# EAGLE schematic core (EAGLE 9.4.2), part 1 of 2

## Sheet 1 of 13: CPU General
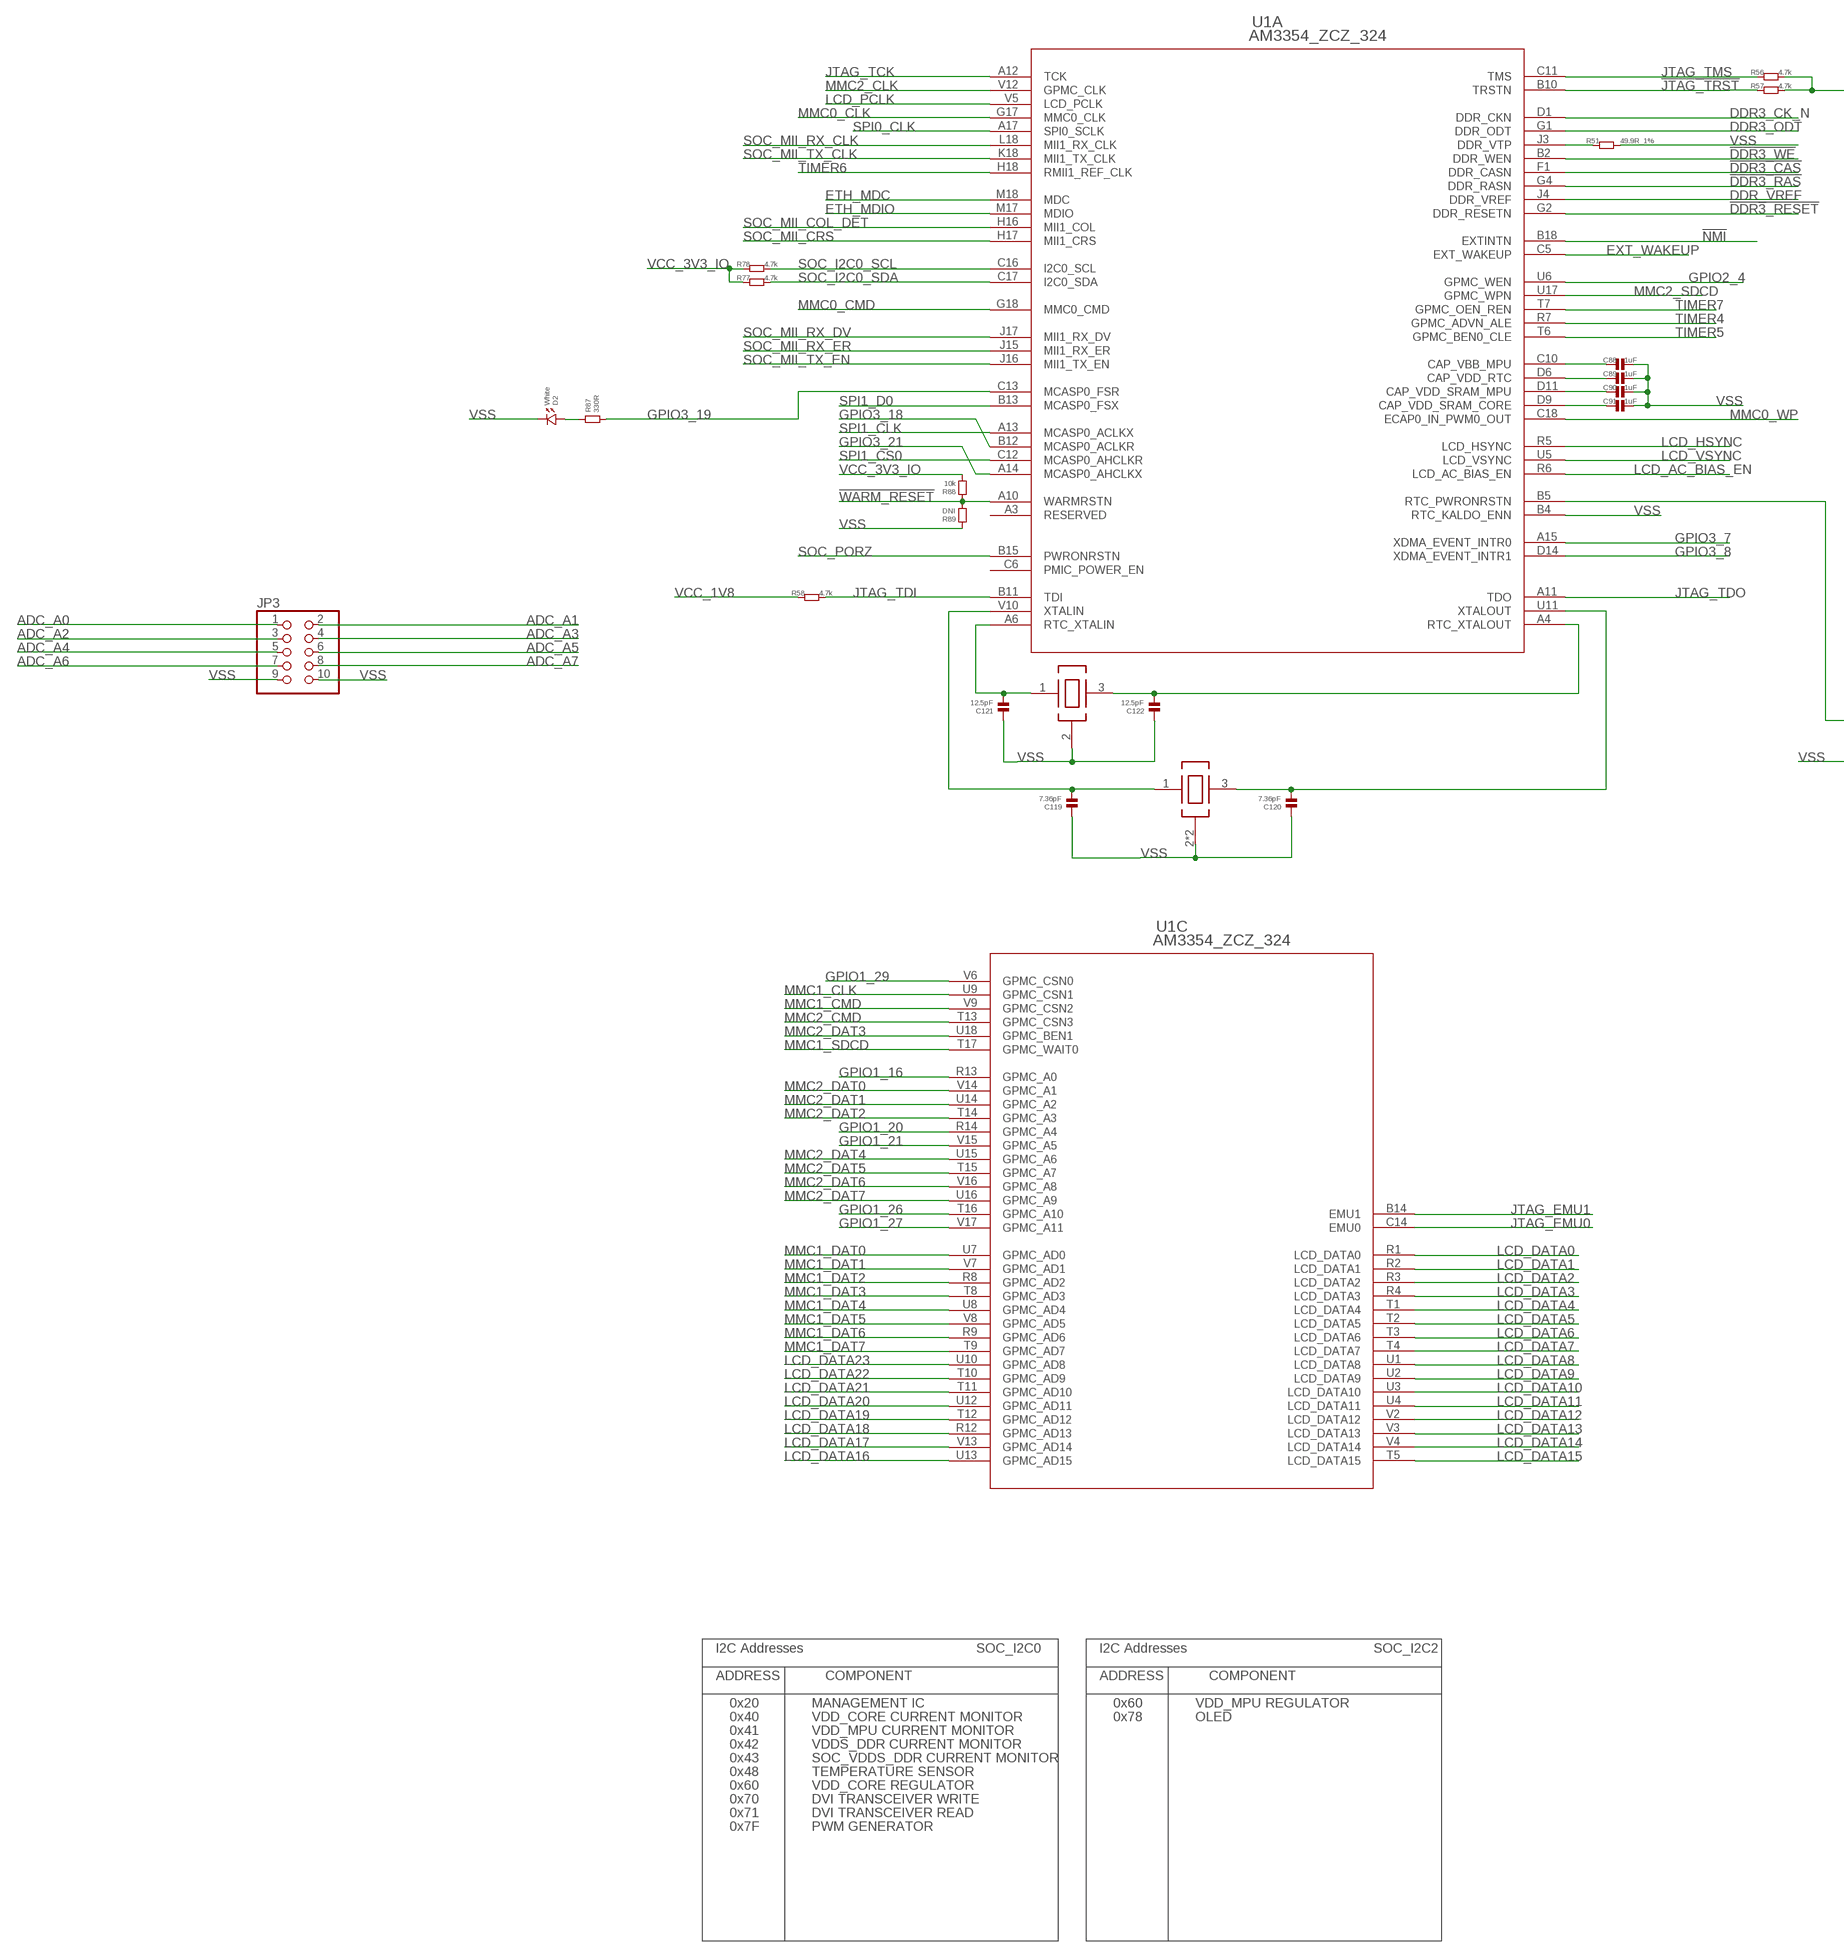
[diagram p0: schematic, sheet 1, part 1 of 2]
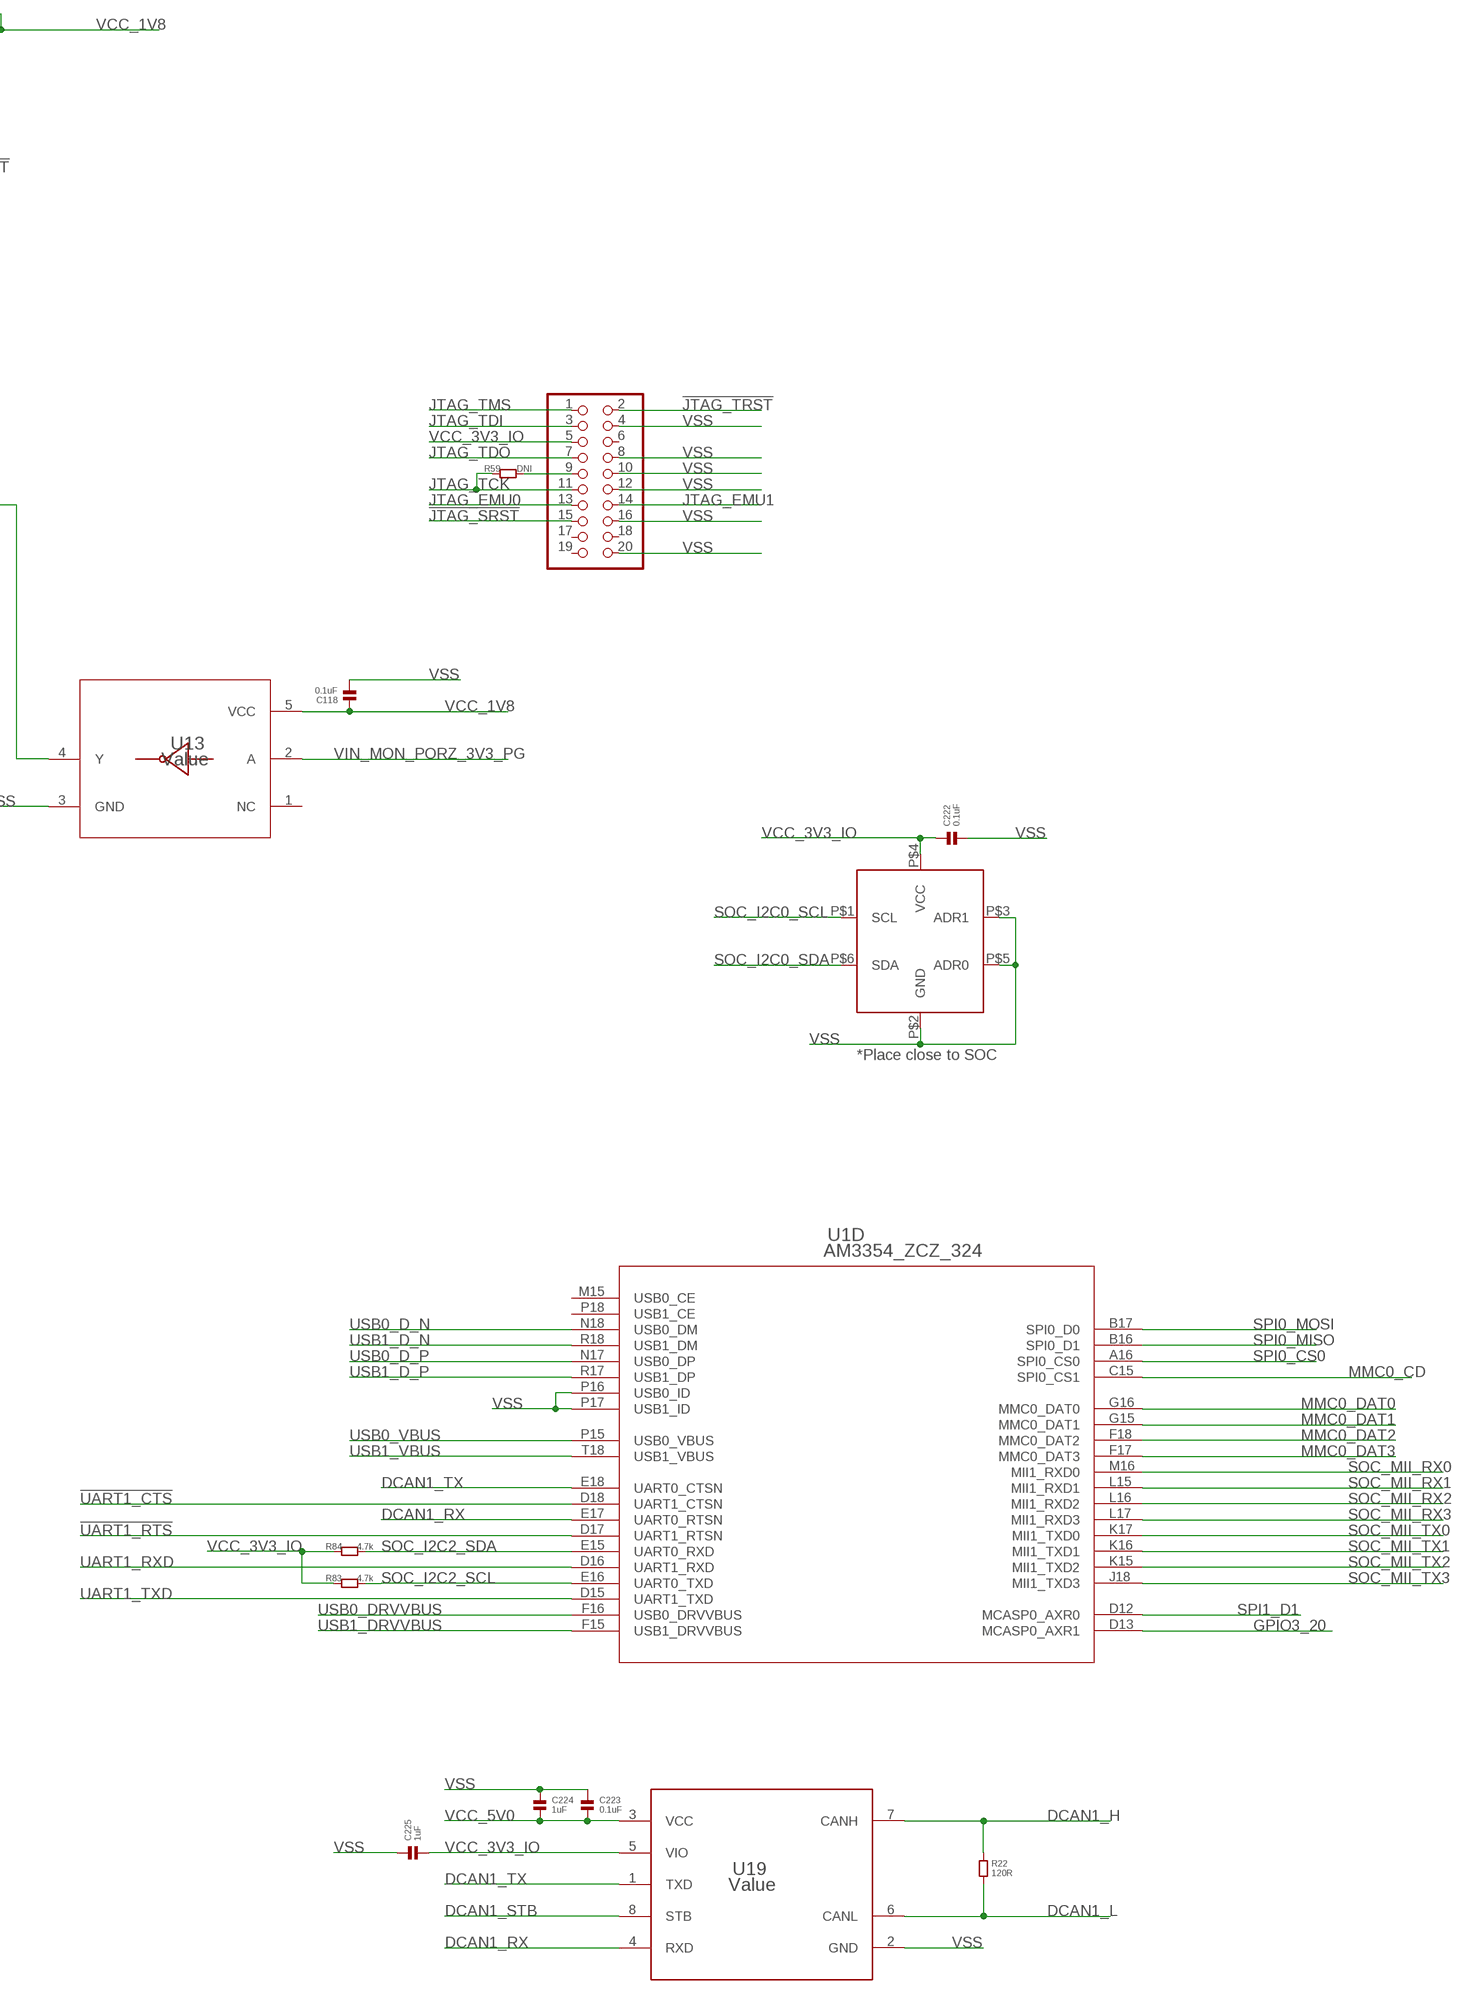
[diagram p1: schematic, sheet 1, part 2 of 2]

### Parts
C88  1uF  CAPACITOR.0201  [0201]
C89  1uF  CAPACITOR.0201  [0201]
C90  1uF  CAPACITOR.0201  [0201]
C91  1uF  CAPACITOR.0201  [0201]
C118  0.1uF  CAPACITOR.0402  [0402]
C119  7.36pF  CAPACITOR.0402  [0402]
C120  7.36pF  CAPACITOR.0402  [0402]
C121  12.5pF  CAPACITOR.0402  [0402]
C122  12.5pF  CAPACITOR.0402  [0402]
C222  0.1uF  CAPACITOR.0402  [0402]
C223  0.1uF  CAPACITOR.0402  [0402]
C224  1uF  CAPACITOR.0402  [0402]
C225  1uF  CAPACITOR.0402  [0402]
D2  White  LED.0603  [0603.LED]
JP1  PINHD-2X10  [2X10]
JP3  PINHD-2X5  [2X05]
R22  120R  RESISTOR.0402  [0402]
R51  49.9R_1%  RESISTOR.0201  [0201]
R56  4.7k  RESISTOR.0603  [0603]
R57  4.7k  RESISTOR.0603  [0603]
R58  4.7k  RESISTOR.0603  [0603]
R59  DNI  RESISTOR.0402  [0402]
R77  4.7k  RESISTOR.0402  [0402]
R78  4.7k  RESISTOR.0402  [0402]
R83  4.7k  RESISTOR.0402  [0402]
R84  4.7k  RESISTOR.0402  [0402]
R87  330R  RESISTOR.0603  [0603]
R88  10k  RESISTOR.0402  [0402]
R89  DNI  RESISTOR.0402  [0402]
U1  AM3354_ZCZ_324  [ZCZ324]
U13  Value  SN74LVC1G04DCKR  [DCK0005A_N]
U19  Value  TCAN1042VDRQ1  [D0008A_N]
U$5  ECS-.327-12.5-1210B-N-TR  [OSCCC120X100X35]
U$6  NX3225SA-26.000000MHZ-G3  [OSCCC320X250X70]
U$9  TMP100  [SOT23-6]

### Nets
!DDR3_CAS: U1.F1(A:DDR_CASN) ; also sheet 3
!DDR3_RAS: U1.G4(A:DDR_RASN) ; also sheet 3
!DDR3_RESET: U1.G2(A:DDR_RESETN) ; also sheet 3
!DDR3_WE: U1.B2(A:DDR_WEN) ; also sheet 3
!JTAG_SRST: JP1.15
!JTAG_TRST: JP1.2 R57.1 U1.B10(A:TRSTN) ; also sheet 11
!NMI: U1.B18(A:EXTINTN) ; also sheet 12
!UART1_CTS: U1.D18(D:UART1_CTSN) ; also sheet 13
!UART1_RTS: U1.D17(D:UART1_RTSN) ; also sheet 13
!WARM_RESET: R88.1 R89.2 U1.A10(A:WARMRSTN) ; also sheet 13
ADC_A0: JP3.1 ; also sheet 3
ADC_A1: JP3.2 ; also sheet 3
ADC_A2: JP3.3 ; also sheet 3
ADC_A3: JP3.4 ; also sheet 3
ADC_A4: JP3.5 ; also sheet 3
ADC_A5: JP3.6 ; also sheet 3
ADC_A6: JP3.7 ; also sheet 3
ADC_A7: JP3.8 ; also sheet 3
DCAN1_H [6mil]: R22.1 U19.7(CANH) ; also sheet 13
DCAN1_L [6mil]: R22.2 U19.6(CANL) ; also sheet 13
DCAN1_RX: U1.E17(D:UART0_RTSN) U19.4(RXD)
DCAN1_STB: U19.8(STB) ; also sheet 12
DCAN1_TX: U1.E18(D:UART0_CTSN) U19.1(TXD)
DDR3_CK_N: U1.D1(A:DDR_CKN) ; also sheet 3
DDR3_ODT: U1.G1(A:DDR_ODT) ; also sheet 3
DDR_VREF: U1.J4(A:DDR_VREF) ; also sheet 3,9
ETH_MDC: U1.M18(A:MDC) ; also sheet 4
ETH_MDIO: U1.M17(A:MDIO) ; also sheet 4
EXT_WAKEUP: U1.C5(A:EXT_WAKEUP) ; also sheet 12,13
GPIO1_16: U1.R13(C:GPMC_A0) ; also sheet 13
GPIO1_20: U1.R14(C:GPMC_A4) ; also sheet 13
GPIO1_21: U1.V15(C:GPMC_A5) ; also sheet 13
GPIO1_26: U1.T16(C:GPMC_A10) ; also sheet 13
GPIO1_27: U1.V17(C:GPMC_A11) ; also sheet 13
GPIO1_29: U1.V6(C:GPMC_CSN0) ; also sheet 13
GPIO2_4: U1.U6(A:GPMC_WEN) ; also sheet 13
GPIO3_7: U1.A15(A:XDMA_EVENT_INTR0) ; also sheet 13
GPIO3_8: U1.D14(A:XDMA_EVENT_INTR1) ; also sheet 13
GPIO3_18: U1.B12(A:MCASP0_ACLKR) ; also sheet 13
GPIO3_19: R87.2 U1.C13(A:MCASP0_FSR) ; also sheet 13
GPIO3_20: U1.D13(D:MCASP0_AXR1) ; also sheet 13
GPIO3_21: U1.A14(A:MCASP0_AHCLKX) ; also sheet 13
JTAG_EMU0: JP1.13 U1.C14(C:EMU0)
JTAG_EMU1: JP1.14 U1.B14(C:EMU1)
JTAG_TCK: JP1.11 R59.1 U1.A12(A:TCK)
JTAG_TDI: JP1.3 R58.2 U1.B11(A:TDI)
JTAG_TDO: JP1.7 U1.A11(A:TDO)
JTAG_TMS: JP1.1 R56.1 U1.C11(A:TMS)
LCD_AC_BIAS_EN: U1.R6(A:LCD_AC_BIAS_EN) ; also sheet 6
LCD_DATA0: U1.R1(C:LCD_DATA0) ; also sheet 6
LCD_DATA1: U1.R2(C:LCD_DATA1) ; also sheet 6
LCD_DATA2: U1.R3(C:LCD_DATA2) ; also sheet 6
LCD_DATA3: U1.R4(C:LCD_DATA3) ; also sheet 6
LCD_DATA4: U1.T1(C:LCD_DATA4) ; also sheet 6
LCD_DATA5: U1.T2(C:LCD_DATA5) ; also sheet 6
LCD_DATA6: U1.T3(C:LCD_DATA6) ; also sheet 6
LCD_DATA7: U1.T4(C:LCD_DATA7) ; also sheet 6
LCD_DATA8: U1.U1(C:LCD_DATA8) ; also sheet 6
LCD_DATA9: U1.U2(C:LCD_DATA9) ; also sheet 6
LCD_DATA10: U1.U3(C:LCD_DATA10) ; also sheet 6
LCD_DATA11: U1.U4(C:LCD_DATA11) ; also sheet 6
LCD_DATA12: U1.V2(C:LCD_DATA12) ; also sheet 6
LCD_DATA13: U1.V3(C:LCD_DATA13) ; also sheet 6
LCD_DATA14: U1.V4(C:LCD_DATA14) ; also sheet 6
LCD_DATA15: U1.T5(C:LCD_DATA15) ; also sheet 6
LCD_DATA16: U1.U13(C:GPMC_AD15) ; also sheet 6
LCD_DATA17: U1.V13(C:GPMC_AD14) ; also sheet 6
LCD_DATA18: U1.R12(C:GPMC_AD13) ; also sheet 6
LCD_DATA19: U1.T12(C:GPMC_AD12) ; also sheet 6
LCD_DATA20: U1.U12(C:GPMC_AD11) ; also sheet 6
LCD_DATA21: U1.T11(C:GPMC_AD10) ; also sheet 6
LCD_DATA22: U1.T10(C:GPMC_AD9) ; also sheet 6
LCD_DATA23: U1.U10(C:GPMC_AD8) ; also sheet 6
LCD_HSYNC: U1.R5(A:LCD_HSYNC) ; also sheet 6
LCD_PCLK: U1.V5(A:LCD_PCLK) ; also sheet 6
LCD_VSYNC: U1.U5(A:LCD_VSYNC) ; also sheet 6
MMC0_CD: U1.C15(D:SPI0_CS1) ; also sheet 8
MMC0_CLK: U1.G17(A:MMC0_CLK) ; also sheet 8
MMC0_CMD: U1.G18(A:MMC0_CMD) ; also sheet 8
MMC0_DAT0: U1.G16(D:MMC0_DAT0) ; also sheet 8
MMC0_DAT1: U1.G15(D:MMC0_DAT1) ; also sheet 8
MMC0_DAT2: U1.F18(D:MMC0_DAT2) ; also sheet 8
MMC0_DAT3: U1.F17(D:MMC0_DAT3) ; also sheet 8
MMC0_WP: U1.C18(A:ECAP0_IN_PWM0_OUT) ; also sheet 8
MMC1_CLK: U1.U9(C:GPMC_CSN1) ; also sheet 8
MMC1_CMD: U1.V9(C:GPMC_CSN2) ; also sheet 8
MMC1_DAT0: U1.U7(C:GPMC_AD0) ; also sheet 8
MMC1_DAT1: U1.V7(C:GPMC_AD1) ; also sheet 8
MMC1_DAT2: U1.R8(C:GPMC_AD2) ; also sheet 8
MMC1_DAT3: U1.T8(C:GPMC_AD3) ; also sheet 8
MMC1_DAT4: U1.U8(C:GPMC_AD4) ; also sheet 8
MMC1_DAT5: U1.V8(C:GPMC_AD5) ; also sheet 8
MMC1_DAT6: U1.R9(C:GPMC_AD6) ; also sheet 8
MMC1_DAT7: U1.T9(C:GPMC_AD7) ; also sheet 8
MMC1_SDCD: U1.T17(C:GPMC_WAIT0)
MMC2_CLK: U1.V12(A:GPMC_CLK) ; also sheet 8
MMC2_CMD: U1.T13(C:GPMC_CSN3) ; also sheet 8
MMC2_DAT0: U1.V14(C:GPMC_A1) ; also sheet 8
MMC2_DAT1: U1.U14(C:GPMC_A2) ; also sheet 8
MMC2_DAT2: U1.T14(C:GPMC_A3) ; also sheet 8
MMC2_DAT3: U1.U18(C:GPMC_BEN1) ; also sheet 8
MMC2_DAT4: U1.U15(C:GPMC_A6) ; also sheet 8
MMC2_DAT5: U1.T15(C:GPMC_A7) ; also sheet 8
MMC2_DAT6: U1.V16(C:GPMC_A8) ; also sheet 8
MMC2_DAT7: U1.U16(C:GPMC_A9) ; also sheet 8
MMC2_SDCD: U1.U17(A:GPMC_WPN)
N$6: JP1.9 R59.2
N$9: C88.1 U1.C10(A:CAP_VBB_MPU)
N$10: C91.1 U1.D9(A:CAP_VDD_SRAM_CORE)
N$11: C90.1 U1.D11(A:CAP_VDD_SRAM_MPU)
N$12: U1.B5(A:RTC_PWRONRSTN) U13.4(Y)
N$13: C121.2 U1.A6(A:RTC_XTALIN) U$5.1(XI)
N$14: C122.2 U1.A4(A:RTC_XTALOUT) U$5.3(XO)
N$15: C119.2 U1.V10(A:XTALIN) U$6.1(XI)
N$16: C120.2 U1.U11(A:XTALOUT) U$6.3(XO)
N$21: R51.1 U1.J3(A:DDR_VTP)
N$25: C89.1 U1.D6(A:CAP_VDD_RTC)
N$38: D2.P$1 R87.1
SOC_I2C0_SCL: R78.2 U1.C16(A:I2C0_SCL) U$9.P$1(SCL) ; also sheet 6,7,9,10,12
SOC_I2C0_SDA: R77.2 U1.C17(A:I2C0_SDA) U$9.P$6(SDA) ; also sheet 6,7,9,10,12
SOC_I2C2_SCL: R83.2 U1.E16(D:UART0_TXD) ; also sheet 9,13
SOC_I2C2_SDA: R84.2 U1.E15(D:UART0_RXD) ; also sheet 9,13
SOC_MII_COL_DET: U1.H16(A:MII1_COL) ; also sheet 4
SOC_MII_CRS: U1.H17(A:MII1_CRS) ; also sheet 4
SOC_MII_RX0: U1.M16(D:MII1_RXD0) ; also sheet 4
SOC_MII_RX1: U1.L15(D:MII1_RXD1) ; also sheet 4
SOC_MII_RX2: U1.L16(D:MII1_RXD2) ; also sheet 4
SOC_MII_RX3: U1.L17(D:MII1_RXD3) ; also sheet 4
SOC_MII_RX_CLK: U1.L18(A:MII1_RX_CLK) ; also sheet 4
SOC_MII_RX_DV: U1.J17(A:MII1_RX_DV) ; also sheet 4
SOC_MII_RX_ER: U1.J15(A:MII1_RX_ER) ; also sheet 4
SOC_MII_TX0: U1.K17(D:MII1_TXD0) ; also sheet 4
SOC_MII_TX1: U1.K16(D:MII1_TXD1) ; also sheet 4
SOC_MII_TX2: U1.K15(D:MII1_TXD2) ; also sheet 4
SOC_MII_TX3: U1.J18(D:MII1_TXD3) ; also sheet 4
SOC_MII_TX_CLK: U1.K18(A:MII1_TX_CLK) ; also sheet 4
SOC_MII_TX_EN: U1.J16(A:MII1_TX_EN) ; also sheet 4
SOC_PORZ: U1.B15(A:PWRONRSTN) ; also sheet 11
SPI0_CLK: U1.A17(A:SPI0_SCLK) ; also sheet 13
SPI0_CS0: U1.A16(D:SPI0_CS0) ; also sheet 13
SPI0_MISO: U1.B16(D:SPI0_D1) ; also sheet 13
SPI0_MOSI: U1.B17(D:SPI0_D0) ; also sheet 13
SPI1_CLK: U1.A13(A:MCASP0_ACLKX) ; also sheet 13
SPI1_CS0: U1.C12(A:MCASP0_AHCLKR) ; also sheet 13
SPI1_D0: U1.B13(A:MCASP0_FSX) ; also sheet 13
SPI1_D1: U1.D12(D:MCASP0_AXR0) ; also sheet 13
TIMER4: U1.R7(A:GPMC_ADVN_ALE) ; also sheet 13
TIMER5: U1.T6(A:GPMC_BEN0_CLE) ; also sheet 13
TIMER6: U1.H18(A:RMII1_REF_CLK) ; also sheet 13
TIMER7: U1.T7(A:GPMC_OEN_REN) ; also sheet 13
UART1_RXD: U1.D16(D:UART1_RXD) ; also sheet 13
UART1_TXD: U1.D15(D:UART1_TXD) ; also sheet 13
USB0_D_N: U1.N18(D:USB0_DM) ; also sheet 5
USB0_D_P: U1.N17(D:USB0_DP) ; also sheet 5
USB0_DRVVBUS: U1.F16(D:USB0_DRVVBUS) ; also sheet 5
USB0_VBUS: U1.P15(D:USB0_VBUS) ; also sheet 5
USB1_D_N: U1.R18(D:USB1_DM) ; also sheet 5
USB1_D_P: U1.R17(D:USB1_DP) ; also sheet 5
USB1_DRVVBUS: U1.F15(D:USB1_DRVVBUS) ; also sheet 5
USB1_VBUS: U1.T18(D:USB1_VBUS) ; also sheet 5
VCC_1V8: C118.1 R56.2 R57.2 R58.1 U13.5(VCC) ; also sheet 2,9
VCC_3V3_IO: C222.1 C225.2 JP1.5 R77.1 R78.1 R83.1 R84.1 R88.2 U19.5(VIO) U$9.P$4(VCC) ; also sheet 2,4,5,6,7,8,9,10,11,12,13
VCC_5V0: C223.2 C224.2 U19.3(VCC) ; also sheet 5,6,9,13
VIN_MON_PORZ_3V3_PG: U13.2(A) ; also sheet 9,11
VSS: C88.2 C89.2 C90.2 C91.2 C118.2 C119.1 C120.1 C121.1 C122.1 C222.2 C223.1 C224.1 C225.1 D2.P$2 JP1.4 JP1.8 JP1.10 JP1.12 JP1.16 JP1.20 JP3.9 JP3.10 R51.2 R89.1 U1.B4(A:RTC_KALDO_ENN) U1.P16(D:USB0_ID) U1.P17(D:USB1_ID) U13.3(GND) U19.2(GND) U$5.2(VSS) U$6.2(VSS) U$6.4(VSS) U$9.P$2(GND) U$9.P$3(ADR1) U$9.P$5(ADR0) ; also sheet 2,3,4,5,6,7,8,9,10,11,12,13
Unconnected: JP1.6 JP1.17 JP1.18 JP1.19 U1.A3(A:RESERVED) U1.C6(A:PMIC_POWER_EN) U1.M15(D:USB0_CE) U1.P18(D:USB1_CE) U13.1(NC)

### Notes on the sheet
- *Place close to SOC
- I2C Addresses | SOC_I2C0 | I2C Addresses | SOC_I2C2
- ADDRESS | COMPONENT | ADDRESS | COMPONENT
- 0x20 | MANAGEMENT IC | 0x60 | VDD_MPU REGULATOR
- 0x40 | VDD_CORE CURRENT MONITOR | 0x78 | OLED
- 0x41 | VDD_MPU CURRENT MONITOR
- 0x42 | VDDS_DDR CURRENT MONITOR
- 0x43 | SOC_VDDS_DDR CURRENT MONITOR
- 0x48 | TEMPERATURE SENSOR
- 0x60 | VDD_CORE REGULATOR
- 0x70 | DVI TRANSCEIVER WRITE
- 0x71 | DVI TRANSCEIVER READ
- 0x7F | PWM GENERATOR

## Sheet 2 of 13: Power and decaps
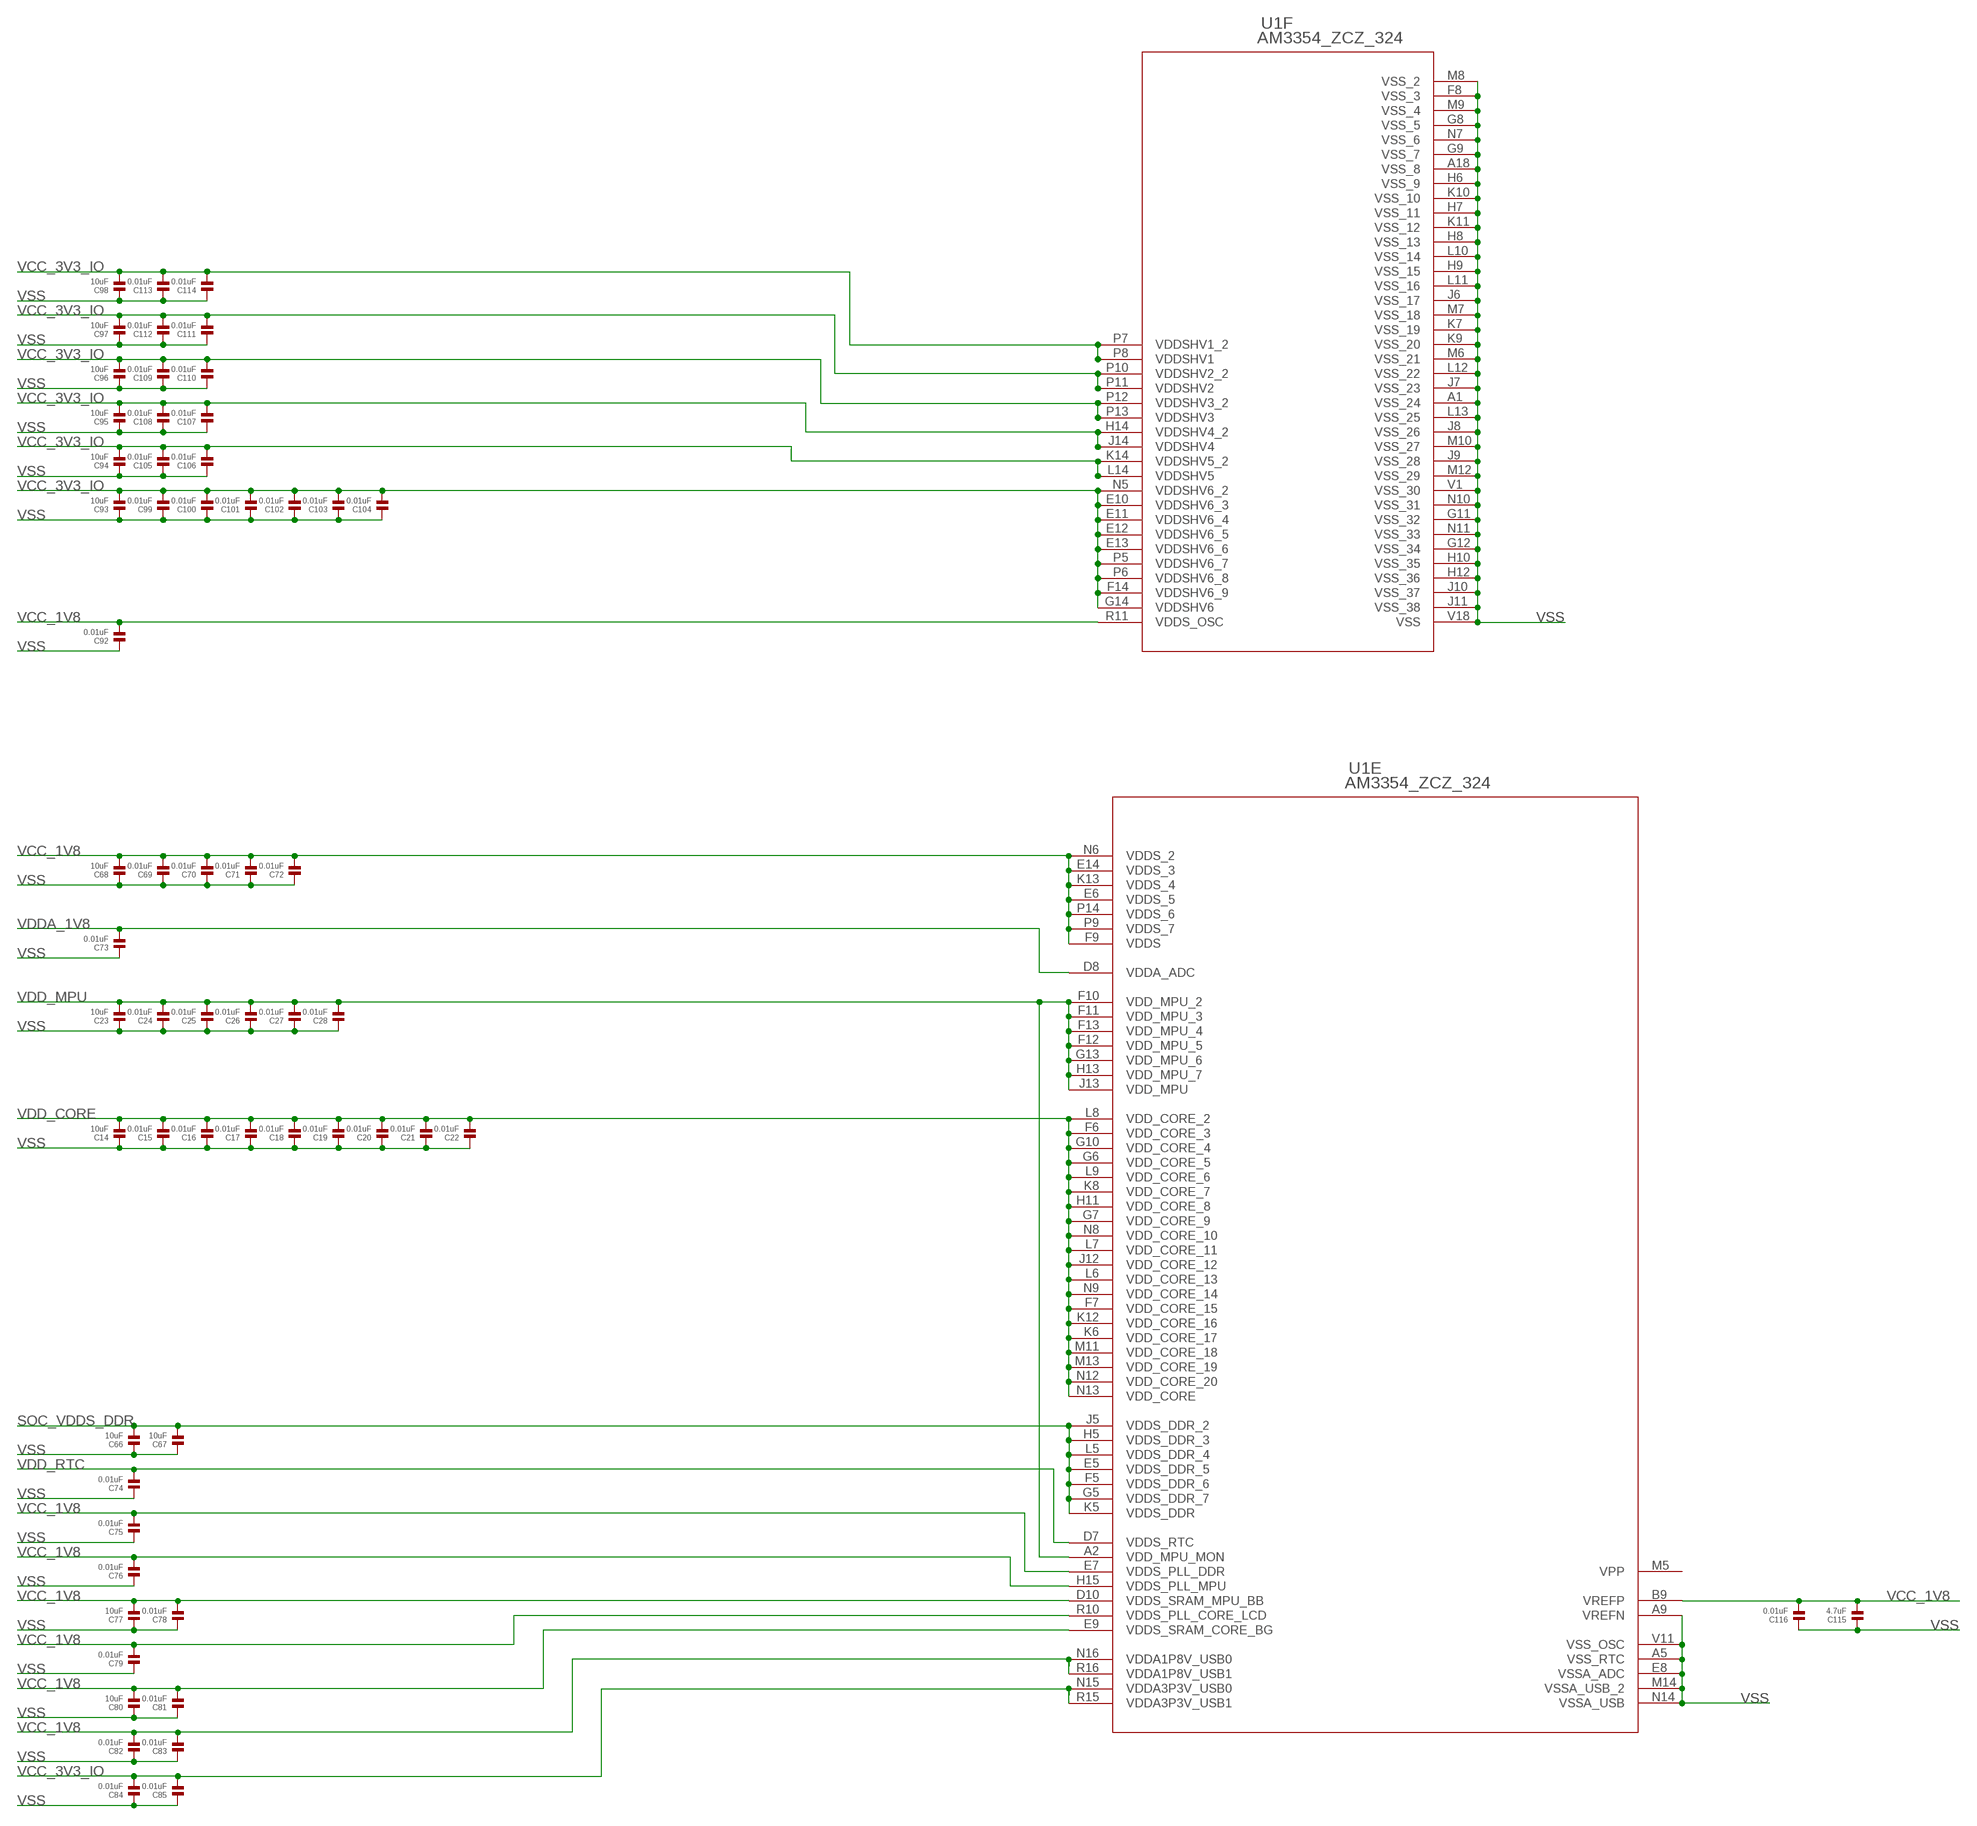
[diagram p2: schematic, sheet 2]

### Parts
C14  10uF  CAPACITOR.0402  [0402]
C15  0.01uF  CAPACITOR.0201  [0201]
C16  0.01uF  CAPACITOR.0201  [0201]
C17  0.01uF  CAPACITOR.0201  [0201]
C18  0.01uF  CAPACITOR.0201  [0201]
C19  0.01uF  CAPACITOR.0201  [0201]
C20  0.01uF  CAPACITOR.0201  [0201]
C21  0.01uF  CAPACITOR.0201  [0201]
C22  0.01uF  CAPACITOR.0201  [0201]
C23  10uF  CAPACITOR.0402  [0402]
C24  0.01uF  CAPACITOR.0201  [0201]
C25  0.01uF  CAPACITOR.0201  [0201]
C26  0.01uF  CAPACITOR.0201  [0201]
C27  0.01uF  CAPACITOR.0201  [0201]
C28  0.01uF  CAPACITOR.0201  [0201]
C66  10uF  CAPACITOR.0402  [0402]
C67  10uF  CAPACITOR.0402  [0402]
C68  10uF  CAPACITOR.0402  [0402]
C69  0.01uF  CAPACITOR.0201  [0201]
C70  0.01uF  CAPACITOR.0201  [0201]
C71  0.01uF  CAPACITOR.0201  [0201]
C72  0.01uF  CAPACITOR.0201  [0201]
C73  0.01uF  CAPACITOR.0201  [0201]
C74  0.01uF  CAPACITOR.0201  [0201]
C75  0.01uF  CAPACITOR.0201  [0201]
C76  0.01uF  CAPACITOR.0201  [0201]
C77  10uF  CAPACITOR.0402  [0402]
C78  0.01uF  CAPACITOR.0201  [0201]
C79  0.01uF  CAPACITOR.0201  [0201]
C80  10uF  CAPACITOR.0402  [0402]
C81  0.01uF  CAPACITOR.0201  [0201]
C82  0.01uF  CAPACITOR.0201  [0201]
C83  0.01uF  CAPACITOR.0201  [0201]
C84  0.01uF  CAPACITOR.0201  [0201]
C85  0.01uF  CAPACITOR.0201  [0201]
C92  0.01uF  CAPACITOR.0201  [0201]
C93  10uF  CAPACITOR.0402  [0402]
C94  10uF  CAPACITOR.0402  [0402]
C95  10uF  CAPACITOR.0402  [0402]
C96  10uF  CAPACITOR.0402  [0402]
C97  10uF  CAPACITOR.0402  [0402]
C98  10uF  CAPACITOR.0402  [0402]
C99  0.01uF  CAPACITOR.0201  [0201]
C100  0.01uF  CAPACITOR.0201  [0201]
C101  0.01uF  CAPACITOR.0201  [0201]
C102  0.01uF  CAPACITOR.0201  [0201]
C103  0.01uF  CAPACITOR.0201  [0201]
C104  0.01uF  CAPACITOR.0201  [0201]
C105  0.01uF  CAPACITOR.0201  [0201]
C106  0.01uF  CAPACITOR.0201  [0201]
C107  0.01uF  CAPACITOR.0201  [0201]
C108  0.01uF  CAPACITOR.0201  [0201]
C109  0.01uF  CAPACITOR.0201  [0201]
C110  0.01uF  CAPACITOR.0201  [0201]
C111  0.01uF  CAPACITOR.0201  [0201]
C112  0.01uF  CAPACITOR.0201  [0201]
C113  0.01uF  CAPACITOR.0201  [0201]
C114  0.01uF  CAPACITOR.0201  [0201]
C115  4.7uF  CAPACITOR.0402  [0402]
C116  0.01uF  CAPACITOR.0201  [0201]

### Nets
SOC_VDDS_DDR: C66.2 C67.2 U1.E5(E:VDDS_DDR_5) U1.F5(E:VDDS_DDR_6) U1.G5(E:VDDS_DDR_7) U1.H5(E:VDDS_DDR_3) U1.J5(E:VDDS_DDR_2) U1.K5(E:VDDS_DDR) U1.L5(E:VDDS_DDR_4) ; also sheet 10
VCC_1V8: C68.2 C69.2 C70.2 C71.2 C72.2 C75.2 C76.2 C77.2 C78.2 C79.2 C80.2 C81.2 C82.2 C83.2 C92.2 C115.2 C116.2 U1.B9(E:VREFP) U1.D10(E:VDDS_SRAM_MPU_BB) U1.E6(E:VDDS_5) U1.E7(E:VDDS_PLL_DDR) U1.E9(E:VDDS_SRAM_CORE_BG) U1.E14(E:VDDS_3) U1.F9(E:VDDS) U1.H15(E:VDDS_PLL_MPU) U1.K13(E:VDDS_4) U1.N6(E:VDDS_2) U1.N16(E:VDDA1P8V_USB0) U1.P9(E:VDDS_7) U1.P14(E:VDDS_6) U1.R10(E:VDDS_PLL_CORE_LCD) U1.R11(F:VDDS_OSC) U1.R16(E:VDDA1P8V_USB1) ; also sheet 1,9
VCC_3V3_IO: C84.2 C85.2 C93.2 C94.2 C95.2 C96.2 C97.2 C98.2 C99.2 C100.2 C101.2 C102.2 C103.2 C104.2 C105.2 C106.2 C107.2 C108.2 C109.2 C110.2 C111.2 C112.2 C113.2 C114.2 U1.E10(F:VDDSHV6_3) U1.E11(F:VDDSHV6_4) U1.E12(F:VDDSHV6_5) U1.E13(F:VDDSHV6_6) U1.F14(F:VDDSHV6_9) U1.G14(F:VDDSHV6) U1.H14(F:VDDSHV4_2) U1.J14(F:VDDSHV4) U1.K14(F:VDDSHV5_2) U1.L14(F:VDDSHV5) U1.N5(F:VDDSHV6_2) U1.N15(E:VDDA3P3V_USB0) U1.P5(F:VDDSHV6_7) U1.P6(F:VDDSHV6_8) U1.P7(F:VDDSHV1_2) U1.P8(F:VDDSHV1) U1.P10(F:VDDSHV2_2) U1.P11(F:VDDSHV2) U1.P12(F:VDDSHV3_2) U1.P13(F:VDDSHV3) U1.R15(E:VDDA3P3V_USB1) ; also sheet 1,4,5,6,7,8,9,10,11,12,13
VDD_CORE: C14.2 C15.2 C16.2 C17.2 C18.2 C19.2 C20.2 C21.2 C22.2 U1.F6(E:VDD_CORE_3) U1.F7(E:VDD_CORE_15) U1.G6(E:VDD_CORE_5) U1.G7(E:VDD_CORE_9) U1.G10(E:VDD_CORE_4) U1.H11(E:VDD_CORE_8) U1.J12(E:VDD_CORE_12) U1.K6(E:VDD_CORE_17) U1.K8(E:VDD_CORE_7) U1.K12(E:VDD_CORE_16) U1.L6(E:VDD_CORE_13) U1.L7(E:VDD_CORE_11) U1.L8(E:VDD_CORE_2) U1.L9(E:VDD_CORE_6) U1.M11(E:VDD_CORE_18) U1.M13(E:VDD_CORE_19) U1.N8(E:VDD_CORE_10) U1.N9(E:VDD_CORE_14) U1.N12(E:VDD_CORE_20) U1.N13(E:VDD_CORE) ; also sheet 9,10
VDD_MPU: C23.2 C24.2 C25.2 C26.2 C27.2 C28.2 U1.A2(E:VDD_MPU_MON) U1.F10(E:VDD_MPU_2) U1.F11(E:VDD_MPU_3) U1.F12(E:VDD_MPU_5) U1.F13(E:VDD_MPU_4) U1.G13(E:VDD_MPU_6) U1.H13(E:VDD_MPU_7) U1.J13(E:VDD_MPU) ; also sheet 9,10,11
VDD_RTC: C74.2 U1.D7(E:VDDS_RTC) ; also sheet 9
VDDA_1V8: C73.2 U1.D8(E:VDDA_ADC) ; also sheet 9
VSS: C14.1 C15.1 C16.1 C17.1 C18.1 C19.1 C20.1 C21.1 C22.1 C23.1 C24.1 C25.1 C26.1 C27.1 C28.1 C66.1 C67.1 C68.1 C69.1 C70.1 C71.1 C72.1 C73.1 C74.1 C75.1 C76.1 C77.1 C78.1 C79.1 C80.1 C81.1 C82.1 C83.1 C84.1 C85.1 C92.1 C93.1 C94.1 C95.1 C96.1 C97.1 C98.1 C99.1 C100.1 C101.1 C102.1 C103.1 C104.1 C105.1 C106.1 C107.1 C108.1 C109.1 C110.1 C111.1 C112.1 C113.1 C114.1 C115.1 C116.1 U1.A1(F:VSS_24) U1.A5(E:VSS_RTC) U1.A9(E:VREFN) U1.A18(F:VSS_8) U1.E8(E:VSSA_ADC) U1.F8(F:VSS_3) U1.G8(F:VSS_5) U1.G9(F:VSS_7) U1.G11(F:VSS_32) U1.G12(F:VSS_34) U1.H6(F:VSS_9) U1.H7(F:VSS_11) U1.H8(F:VSS_13) U1.H9(F:VSS_15) U1.H10(F:VSS_35) U1.H12(F:VSS_36) U1.J6(F:VSS_17) U1.J7(F:VSS_23) U1.J8(F:VSS_26) U1.J9(F:VSS_28) U1.J10(F:VSS_37) U1.J11(F:VSS_38) U1.K7(F:VSS_19) U1.K9(F:VSS_20) U1.K10(F:VSS_10) U1.K11(F:VSS_12) U1.L10(F:VSS_14) U1.L11(F:VSS_16) U1.L12(F:VSS_22) U1.L13(F:VSS_25) U1.M6(F:VSS_21) U1.M7(F:VSS_18) U1.M8(F:VSS_2) U1.M9(F:VSS_4) U1.M10(F:VSS_27) U1.M12(F:VSS_29) U1.M14(E:VSSA_USB_2) U1.N7(F:VSS_6) U1.N10(F:VSS_31) U1.N11(F:VSS_33) U1.N14(E:VSSA_USB) U1.V1(F:VSS_30) U1.V11(E:VSS_OSC) U1.V18(F:VSS) ; also sheet 1,3,4,5,6,7,8,9,10,11,12,13

## Sheet 3 of 13: DDR3 RAM
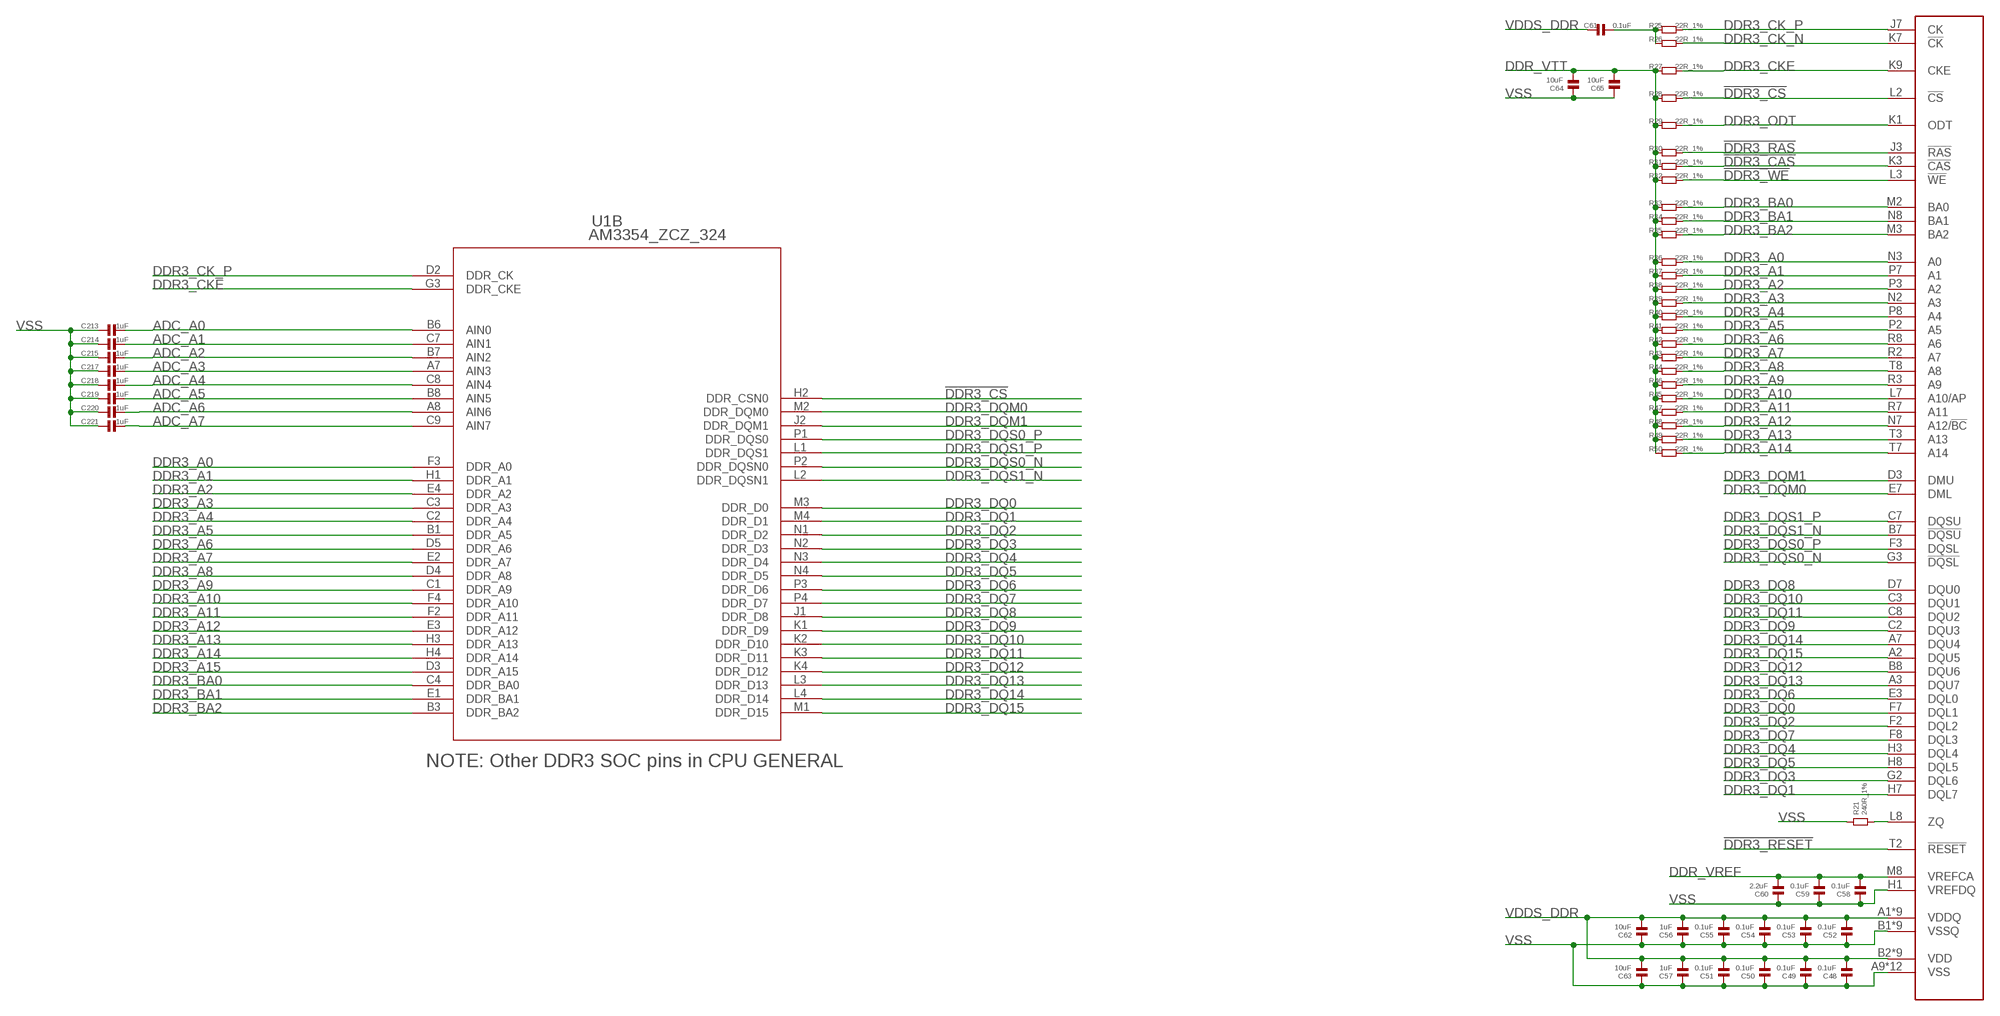
[diagram p3: schematic, sheet 3]

### Parts
C48  0.1uF  CAPACITOR.0402  [0402]
C49  0.1uF  CAPACITOR.0402  [0402]
C50  0.1uF  CAPACITOR.0402  [0402]
C51  0.1uF  CAPACITOR.0402  [0402]
C52  0.1uF  CAPACITOR.0402  [0402]
C53  0.1uF  CAPACITOR.0402  [0402]
C54  0.1uF  CAPACITOR.0402  [0402]
C55  0.1uF  CAPACITOR.0402  [0402]
C56  1uF  CAPACITOR.0402  [0402]
C57  1uF  CAPACITOR.0402  [0402]
C58  0.1uF  CAPACITOR.0201  [0201]
C59  0.1uF  CAPACITOR.0402  [0402]
C60  2.2uF  CAPACITOR.0603  [0603]
C61  0.1uF  CAPACITOR.0201  [0201]
C62  10uF  CAPACITOR.0603  [0603]
C63  10uF  CAPACITOR.0603  [0603]
C64  10uF  CAPACITOR.0402  [0402]
C65  10uF  CAPACITOR.0402  [0402]
C213  1uF  CAPACITOR.0402  [0402]
C214  1uF  CAPACITOR.0402  [0402]
C215  1uF  CAPACITOR.0402  [0402]
C217  1uF  CAPACITOR.0402  [0402]
C218  1uF  CAPACITOR.0402  [0402]
C219  1uF  CAPACITOR.0402  [0402]
C220  1uF  CAPACITOR.0402  [0402]
C221  1uF  CAPACITOR.0402  [0402]
R21  240R_1%  RESISTOR.0402  [0402]
R25  22R_1%  RESISTOR.0201  [0201]
R26  22R_1%  RESISTOR.0201  [0201]
R27  22R_1%  RESISTOR.0201  [0201]
R28  22R_1%  RESISTOR.0201  [0201]
R29  22R_1%  RESISTOR.0201  [0201]
R30  22R_1%  RESISTOR.0201  [0201]
R31  22R_1%  RESISTOR.0201  [0201]
R32  22R_1%  RESISTOR.0201  [0201]
R33  22R_1%  RESISTOR.0201  [0201]
R34  22R_1%  RESISTOR.0201  [0201]
R35  22R_1%  RESISTOR.0201  [0201]
R36  22R_1%  RESISTOR.0201  [0201]
R37  22R_1%  RESISTOR.0201  [0201]
R38  22R_1%  RESISTOR.0201  [0201]
R39  22R_1%  RESISTOR.0201  [0201]
R40  22R_1%  RESISTOR.0201  [0201]
R41  22R_1%  RESISTOR.0201  [0201]
R42  22R_1%  RESISTOR.0201  [0201]
R43  22R_1%  RESISTOR.0201  [0201]
R44  22R_1%  RESISTOR.0201  [0201]
R45  22R_1%  RESISTOR.0201  [0201]
R46  22R_1%  RESISTOR.0201  [0201]
R47  22R_1%  RESISTOR.0201  [0201]
R48  22R_1%  RESISTOR.0201  [0201]
R49  22R_1%  RESISTOR.0201  [0201]
R50  22R_1%  RESISTOR.0201  [0201]
U9  AS4C256M16D3B-12BIN  [BGA144C80P9X16_1350X900X120]

### Nets
!DDR3_CAS: R31.2 U9.K3(!CAS) ; also sheet 1
!DDR3_CS: R28.2 U1.H2(B:DDR_CSN0) U9.L2(!CS)
!DDR3_RAS: R30.2 U9.J3(!RAS) ; also sheet 1
!DDR3_RESET: U9.T2(!RESET) ; also sheet 1
!DDR3_WE: R32.2 U9.L3(!WE) ; also sheet 1
ADC_A0: C213.2 U1.B6(B:AIN0) ; also sheet 1
ADC_A1: C214.2 U1.C7(B:AIN1) ; also sheet 1
ADC_A2: C215.2 U1.B7(B:AIN2) ; also sheet 1
ADC_A3: C217.2 U1.A7(B:AIN3) ; also sheet 1
ADC_A4: C218.2 U1.C8(B:AIN4) ; also sheet 1
ADC_A5: C219.2 U1.B8(B:AIN5) ; also sheet 1
ADC_A6: C220.2 U1.A8(B:AIN6) ; also sheet 1
ADC_A7: C221.2 U1.C9(B:AIN7) ; also sheet 1
DDR3_A0: R36.2 U1.F3(B:DDR_A0) U9.N3(A0)
DDR3_A1: R37.2 U1.H1(B:DDR_A1) U9.P7(A1)
DDR3_A2: R38.2 U1.E4(B:DDR_A2) U9.P3(A2)
DDR3_A3: R39.2 U1.C3(B:DDR_A3) U9.N2(A3)
DDR3_A4: R40.2 U1.C2(B:DDR_A4) U9.P8(A4)
DDR3_A5: R41.2 U1.B1(B:DDR_A5) U9.P2(A5)
DDR3_A6: R42.2 U1.D5(B:DDR_A6) U9.R8(A6)
DDR3_A7: R43.2 U1.E2(B:DDR_A7) U9.R2(A7)
DDR3_A8: R44.2 U1.D4(B:DDR_A8) U9.T8(A8)
DDR3_A9: R46.2 U1.C1(B:DDR_A9) U9.R3(A9)
DDR3_A10: R45.2 U1.F4(B:DDR_A10) U9.L7(A10/AP)
DDR3_A11: R47.2 U1.F2(B:DDR_A11) U9.R7(A11)
DDR3_A12: R48.2 U1.E3(B:DDR_A12) U9.N7(A12/!BC)
DDR3_A13: R49.2 U1.H3(B:DDR_A13) U9.T3(A13)
DDR3_A14: R50.2 U1.H4(B:DDR_A14) U9.T7(A14)
DDR3_A15: U1.D3(B:DDR_A15)
DDR3_BA0: R33.2 U1.C4(B:DDR_BA0) U9.M2(BA0)
DDR3_BA1: R34.2 U1.E1(B:DDR_BA1) U9.N8(BA1)
DDR3_BA2: R35.2 U1.B3(B:DDR_BA2) U9.M3(BA2)
DDR3_CK_N: R26.2 U9.K7(!CK) ; also sheet 1
DDR3_CK_P: R25.2 U1.D2(B:DDR_CK) U9.J7(CK)
DDR3_CKE: R27.2 U1.G3(B:DDR_CKE) U9.K9(CKE)
DDR3_DQ0: U1.M3(B:DDR_D0) U9.F7(DQL1)
DDR3_DQ1: U1.M4(B:DDR_D1) U9.H7(DQL7)
DDR3_DQ2: U1.N1(B:DDR_D2) U9.F2(DQL2)
DDR3_DQ3: U1.N2(B:DDR_D3) U9.G2(DQL6)
DDR3_DQ4: U1.N3(B:DDR_D4) U9.H3(DQL4)
DDR3_DQ5: U1.N4(B:DDR_D5) U9.H8(DQL5)
DDR3_DQ6: U1.P3(B:DDR_D6) U9.E3(DQL0)
DDR3_DQ7: U1.P4(B:DDR_D7) U9.F8(DQL3)
DDR3_DQ8: U1.J1(B:DDR_D8) U9.D7(DQU0)
DDR3_DQ9: U1.K1(B:DDR_D9) U9.C2(DQU3)
DDR3_DQ10: U1.K2(B:DDR_D10) U9.C3(DQU1)
DDR3_DQ11: U1.K3(B:DDR_D11) U9.C8(DQU2)
DDR3_DQ12: U1.K4(B:DDR_D12) U9.B8(DQU6)
DDR3_DQ13: U1.L3(B:DDR_D13) U9.A3(DQU7)
DDR3_DQ14: U1.L4(B:DDR_D14) U9.A7(DQU4)
DDR3_DQ15: U1.M1(B:DDR_D15) U9.A2(DQU5)
DDR3_DQM0: U1.M2(B:DDR_DQM0) U9.E7(DML)
DDR3_DQM1: U1.J2(B:DDR_DQM1) U9.D3(DMU)
DDR3_DQS0_N: U1.P2(B:DDR_DQSN0) U9.G3(!DQSL)
DDR3_DQS0_P: U1.P1(B:DDR_DQS0) U9.F3(DQSL)
DDR3_DQS1_N: U1.L2(B:DDR_DQSN1) U9.B7(!DQSU)
DDR3_DQS1_P: U1.L1(B:DDR_DQS1) U9.C7(DQSU)
DDR3_ODT: R29.2 U9.K1(ODT) ; also sheet 1
DDR_VREF: C58.2 C59.2 C60.2 U9.M8(VREFCA) ; also sheet 1,9
DDR_VTT: C64.2 C65.2 R27.1 R28.1 R29.1 R30.1 R31.1 R32.1 R33.1 R34.1 R35.1 R36.1 R37.1 R38.1 R39.1 R40.1 R41.1 R42.1 R43.1 R44.1 R45.1 R46.1 R47.1 R48.1 R49.1 R50.1 ; also sheet 9
N$7: R21.2 U9.L8(ZQ)
N$8: C61.2 R25.1 R26.1
VDDS_DDR: C48.2 C49.2 C50.2 C51.2 C52.2 C53.2 C54.2 C55.2 C56.2 C57.2 C61.1 C62.2 C63.2 U9.A1(VDDQ) U9.A8(VDDQ) U9.B2(VDD) U9.C1(VDDQ) U9.C9(VDDQ) U9.D2(VDDQ) U9.D9(VDD) U9.E9(VDDQ) U9.F1(VDDQ) U9.G7(VDD) U9.H2(VDDQ) U9.H9(VDDQ) U9.K2(VDD) U9.K8(VDD) U9.N1(VDD) U9.N9(VDD) U9.R1(VDD) U9.R9(VDD) ; also sheet 10
VSS: C48.1 C49.1 C50.1 C51.1 C52.1 C53.1 C54.1 C55.1 C56.1 C57.1 C58.1 C59.1 C60.1 C62.1 C63.1 C64.1 C65.1 C213.1 C214.1 C215.1 C217.1 C218.1 C219.1 C220.1 C221.1 R21.1 U9.A9(VSS) U9.B1(VSSQ) U9.B3(VSS) U9.B9(VSSQ) U9.D1(VSSQ) U9.D8(VSSQ) U9.E1(VSS) U9.E2(VSSQ) U9.E8(VSSQ) U9.F9(VSSQ) U9.G1(VSSQ) U9.G8(VSS) U9.G9(VSSQ) U9.H1(VREFDQ) U9.J2(VSS) U9.J8(VSS) U9.M1(VSS) U9.M9(VSS) U9.P1(VSS) U9.P9(VSS) U9.T1(VSS) U9.T9(VSS) ; also sheet 1,2,4,5,6,7,8,9,10,11,12,13

### Notes on the sheet
- NOTE: Other DDR3 SOC pins in CPU GENERAL

## Sheet 4 of 13: Ethernet
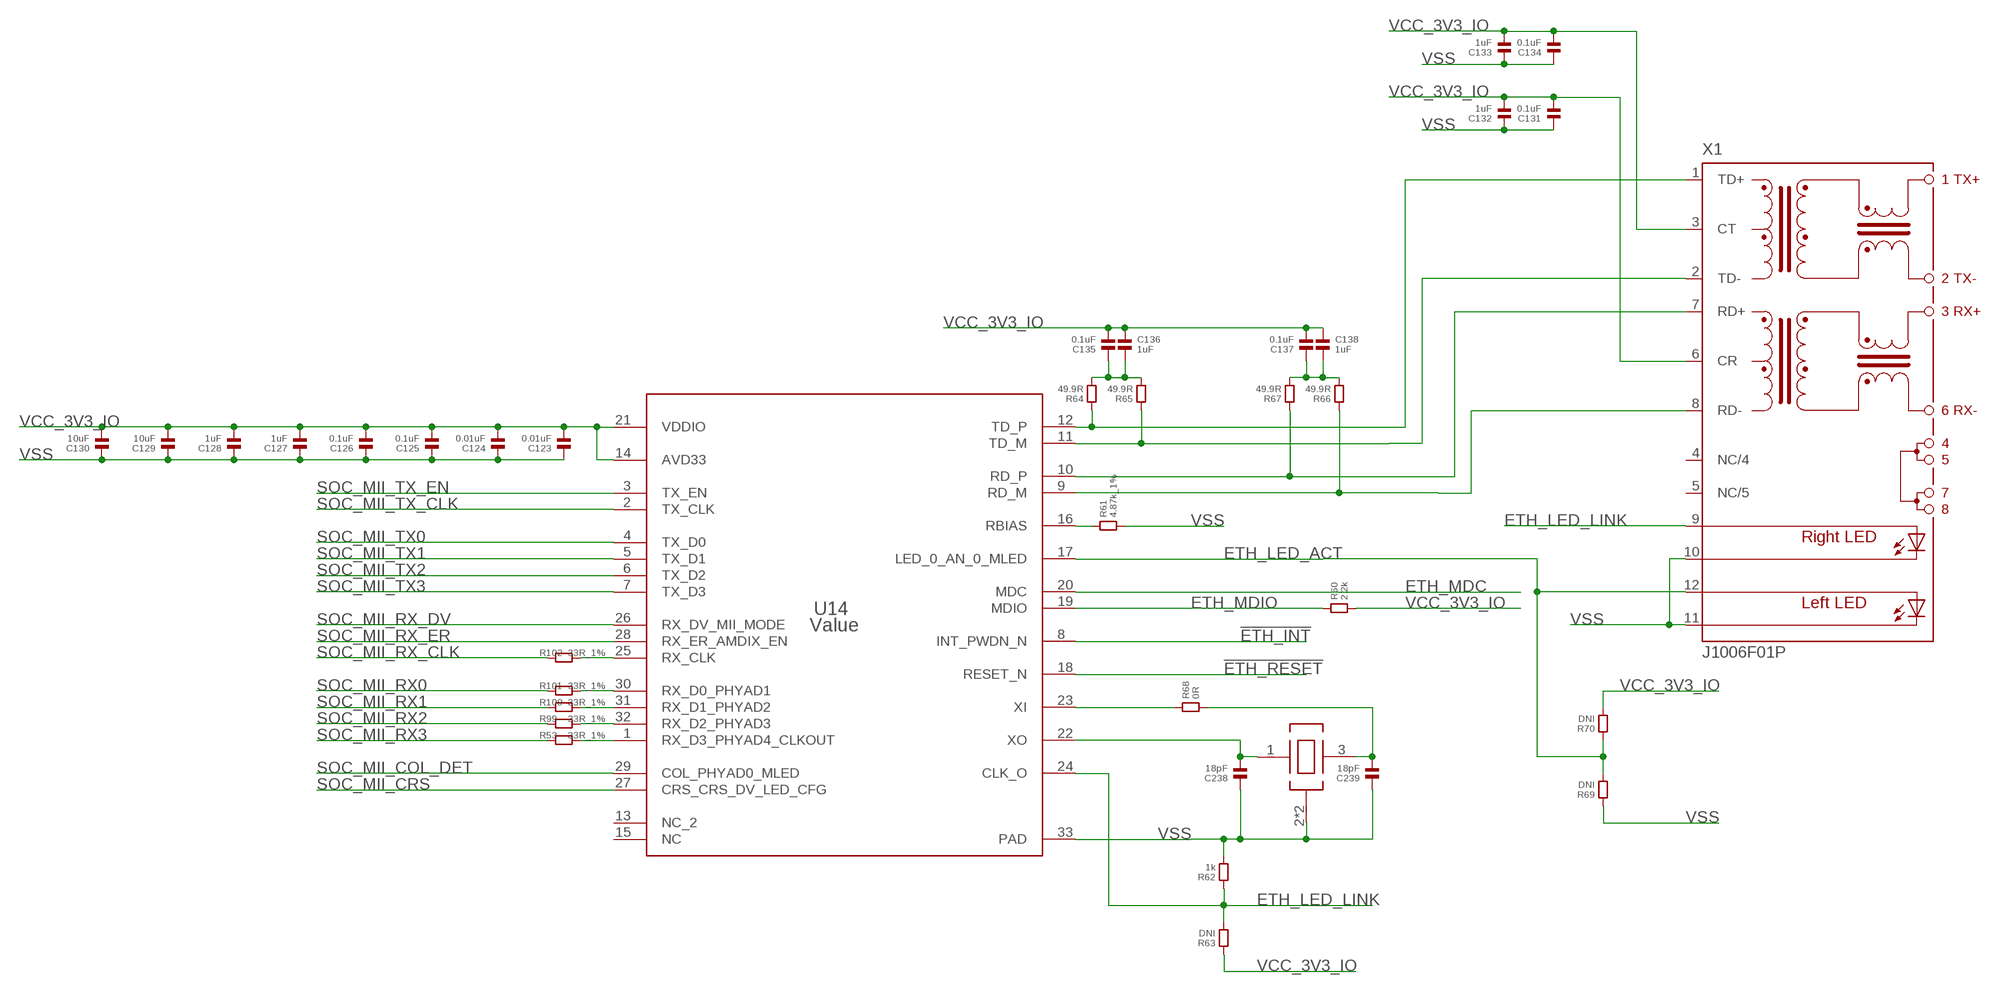
[diagram p4: schematic, sheet 4]

### Parts
C123  0.01uF  CAPACITOR.0402  [0402]
C124  0.01uF  CAPACITOR.0402  [0402]
C125  0.1uF  CAPACITOR.0402  [0402]
C126  0.1uF  CAPACITOR.0402  [0402]
C127  1uF  CAPACITOR.0402  [0402]
C128  1uF  CAPACITOR.0402  [0402]
C129  10uF  CAPACITOR.0402  [0402]
C130  10uF  CAPACITOR.0402  [0402]
C131  0.1uF  CAPACITOR.0402  [0402]
C132  1uF  CAPACITOR.0402  [0402]
C133  1uF  CAPACITOR.0402  [0402]
C134  0.1uF  CAPACITOR.0402  [0402]
C135  0.1uF  CAPACITOR.0402  [0402]
C136  1uF  CAPACITOR.0402  [0402]
C137  0.1uF  CAPACITOR.0402  [0402]
C138  1uF  CAPACITOR.0402  [0402]
C238  18pF  CAPACITOR.0402  [0402]
C239  18pF  CAPACITOR.0402  [0402]
R53  33R_1%  RESISTOR.0402  [0402]
R60  2.2k  RESISTOR.0402  [0402]
R61  4.87k_1%  RESISTOR.0402  [0402]
R62  1k  RESISTOR.0402  [0402]
R63  DNI  RESISTOR.0402  [0402]
R64  49.9R  RESISTOR.0402  [0402]
R65  49.9R  RESISTOR.0402  [0402]
R66  49.9R  RESISTOR.0402  [0402]
R67  49.9R  RESISTOR.0402  [0402]
R68  0R  RESISTOR.0402  [0402]
R69  DNI  RESISTOR.0402  [0402]
R70  DNI  RESISTOR.0402  [0402]
R99  33R_1%  RESISTOR.0402  [0402]
R100  33R_1%  RESISTOR.0402  [0402]
R101  33R_1%  RESISTOR.0402  [0402]
R102  33R_1%  RESISTOR.0402  [0402]
U14  Value  DP83822HRHBR  [RHB0032B]
U$7  ECS-250-18-36B-CKY-TR  [OSCCC250X200X65]
X1  J1006F01P  [J1]

### Nets
!ETH_INT: U14.8(INT_PWDN_N) ; also sheet 12
!ETH_RESET: U14.18(RESET_N) ; also sheet 12
ETH_LED_ACT: R69.2 R70.1 U14.17(LED_0_AN_0_MLED) X1.12(A-L)
ETH_LED_LINK: R62.1 R63.2 U14.24(CLK_O) X1.9(A-R)
ETH_MDC: U14.20(MDC) ; also sheet 1
ETH_MDIO: R60.1 U14.19(MDIO) ; also sheet 1
N$26: R61.1 U14.16(RBIAS)
N$32: C238.2 U14.22(XO) U$7.1(XI)
N$34: C239.2 R68.2 U$7.3(XO)
N$36: R66.1 U14.9(RD_M) X1.8(RD-)
N$37: R67.1 U14.10(RD_P) X1.7(RD+)
N$40: C135.1 C136.2 R64.2 R65.2
N$41: R68.1 U14.23(XI)
N$42: C137.1 C138.2 R66.2 R67.2
N$43: R65.1 U14.11(TD_M) X1.2(TD-)
N$45: R64.1 U14.12(TD_P) X1.1(TD+)
N$67: R53.2 U14.1(RX_D3_PHYAD4_CLKOUT)
N$68: R99.2 U14.32(RX_D2_PHYAD3)
N$69: R100.2 U14.31(RX_D1_PHYAD2)
N$70: R101.2 U14.30(RX_D0_PHYAD1)
N$71: R102.2 U14.25(RX_CLK)
SOC_MII_COL_DET: U14.29(COL_PHYAD0_MLED) ; also sheet 1
SOC_MII_CRS: U14.27(CRS_CRS_DV_LED_CFG) ; also sheet 1
SOC_MII_RX0: R101.1 ; also sheet 1
SOC_MII_RX1: R100.1 ; also sheet 1
SOC_MII_RX2: R99.1 ; also sheet 1
SOC_MII_RX3: R53.1 ; also sheet 1
SOC_MII_RX_CLK: R102.1 ; also sheet 1
SOC_MII_RX_DV: U14.26(RX_DV_MII_MODE) ; also sheet 1
SOC_MII_RX_ER: U14.28(RX_ER_AMDIX_EN) ; also sheet 1
SOC_MII_TX0: U14.4(TX_D0) ; also sheet 1
SOC_MII_TX1: U14.5(TX_D1) ; also sheet 1
SOC_MII_TX2: U14.6(TX_D2) ; also sheet 1
SOC_MII_TX3: U14.7(TX_D3) ; also sheet 1
SOC_MII_TX_CLK: U14.2(TX_CLK) ; also sheet 1
SOC_MII_TX_EN: U14.3(TX_EN) ; also sheet 1
VCC_3V3_IO: C123.2 C124.2 C125.2 C126.2 C127.2 C128.2 C129.2 C130.2 C131.2 C132.2 C133.2 C134.2 C135.2 C136.1 C137.2 C138.1 R60.2 R63.1 R70.2 U14.14(AVD33) U14.21(VDDIO) X1.3(CT) X1.6(CR) ; also sheet 1,2,5,6,7,8,9,10,11,12,13
VSS: C123.1 C124.1 C125.1 C126.1 C127.1 C128.1 C129.1 C130.1 C131.1 C132.1 C133.1 C134.1 C238.1 C239.1 R61.2 R62.2 R69.1 U14.33(PAD) U$7.2(VSS) U$7.4(VSS) X1.10(C-R) X1.11(C-L) ; also sheet 1,2,3,5,6,7,8,9,10,11,12,13
Unconnected: U14.13(NC_2) U14.15(NC) X1.4(NC/4) X1.5(NC/5)

## Sheet 5 of 13: USB
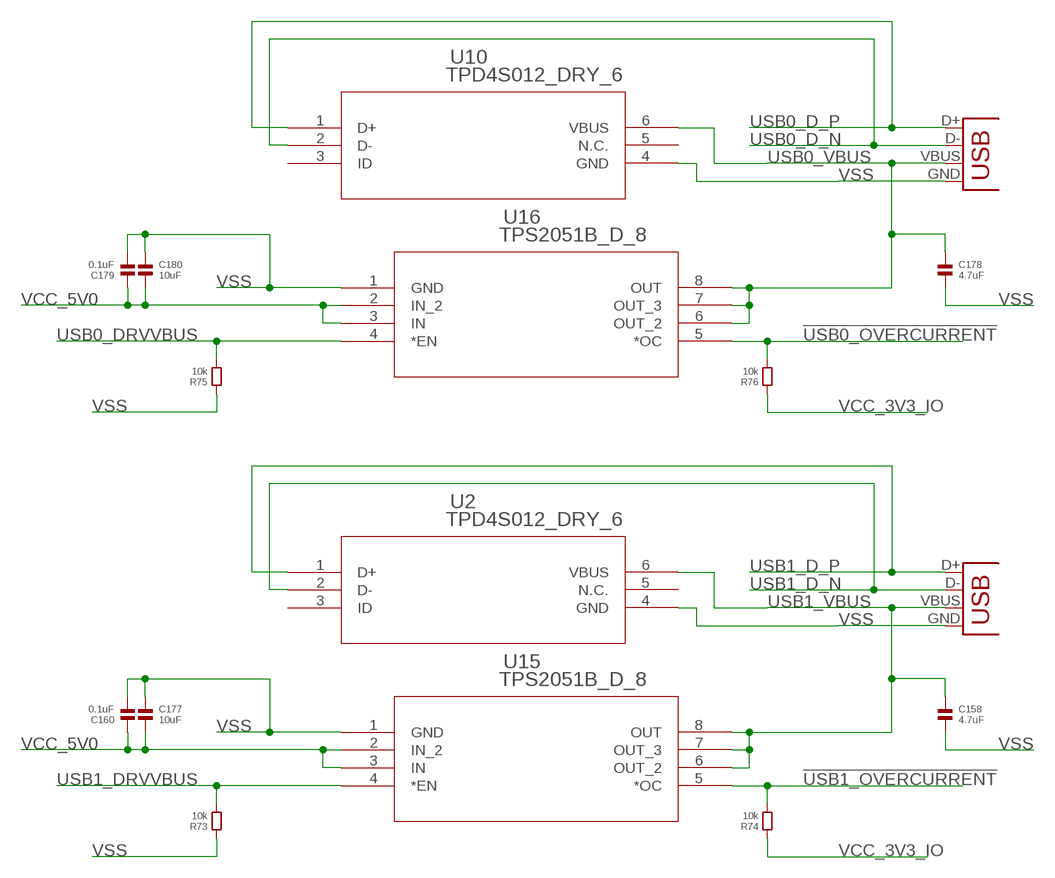
[diagram p5: schematic, sheet 5]

### Parts
C158  4.7uF  CAPACITOR.0603  [0603]
C160  0.1uF  CAPACITOR.0603  [0603]
C177  10uF  CAPACITOR.0603  [0603]
C178  4.7uF  CAPACITOR.0603  [0603]
C179  0.1uF  CAPACITOR.0603  [0603]
C180  10uF  CAPACITOR.0603  [0603]
R73  10k  RESISTOR.0402  [0402]
R74  10k  RESISTOR.0402  [0402]
R75  10k  RESISTOR.0402  [0402]
R76  10k  RESISTOR.0402  [0402]
U2  TPD4S012_DRY_6  [DRY6]
U10  TPD4S012_DRY_6  [DRY6]
U15  TPS2051B_D_8  [D8]
U16  TPS2051B_D_8  [D8]
X2  USB-A-H  [USB-A-H]
X3  USB-A-H  [USB-A-H]

### Nets
!USB0_OVERCURRENT: R76.2 U16.5(*OC) ; also sheet 12
!USB1_OVERCURRENT: R74.2 U15.5(*OC) ; also sheet 12
USB0_D_N: U10.2(D-) X3.D- ; also sheet 1
USB0_D_P: U10.1(D+) X3.D+ ; also sheet 1
USB0_DRVVBUS: R75.2 U16.4(*EN) ; also sheet 1
USB0_VBUS: C178.1 U10.6(VBUS) U16.6(OUT_2) U16.7(OUT_3) U16.8(OUT) X3.VBUS ; also sheet 1
USB1_D_N: U2.2(D-) X2.D- ; also sheet 1
USB1_D_P: U2.1(D+) X2.D+ ; also sheet 1
USB1_DRVVBUS: R73.2 U15.4(*EN) ; also sheet 1
USB1_VBUS: C158.1 U2.6(VBUS) U15.6(OUT_2) U15.7(OUT_3) U15.8(OUT) X2.VBUS ; also sheet 1
VCC_3V3_IO: R74.1 R76.1 ; also sheet 1,2,4,6,7,8,9,10,11,12,13
VCC_5V0: C160.1 C177.2 C179.1 C180.2 U15.2(IN_2) U15.3(IN) U16.2(IN_2) U16.3(IN) ; also sheet 1,6,9,13
VSS: C158.2 C160.2 C177.1 C178.2 C179.2 C180.1 R73.1 R75.1 U2.4(GND) U10.4(GND) U15.1(GND) U16.1(GND) X2.GND X3.GND ; also sheet 1,2,3,4,6,7,8,9,10,11,12,13
Unconnected: U2.3(ID) U2.5(N.C.) U10.3(ID) U10.5(N.C.)

## Sheet 6 of 13: HDMI
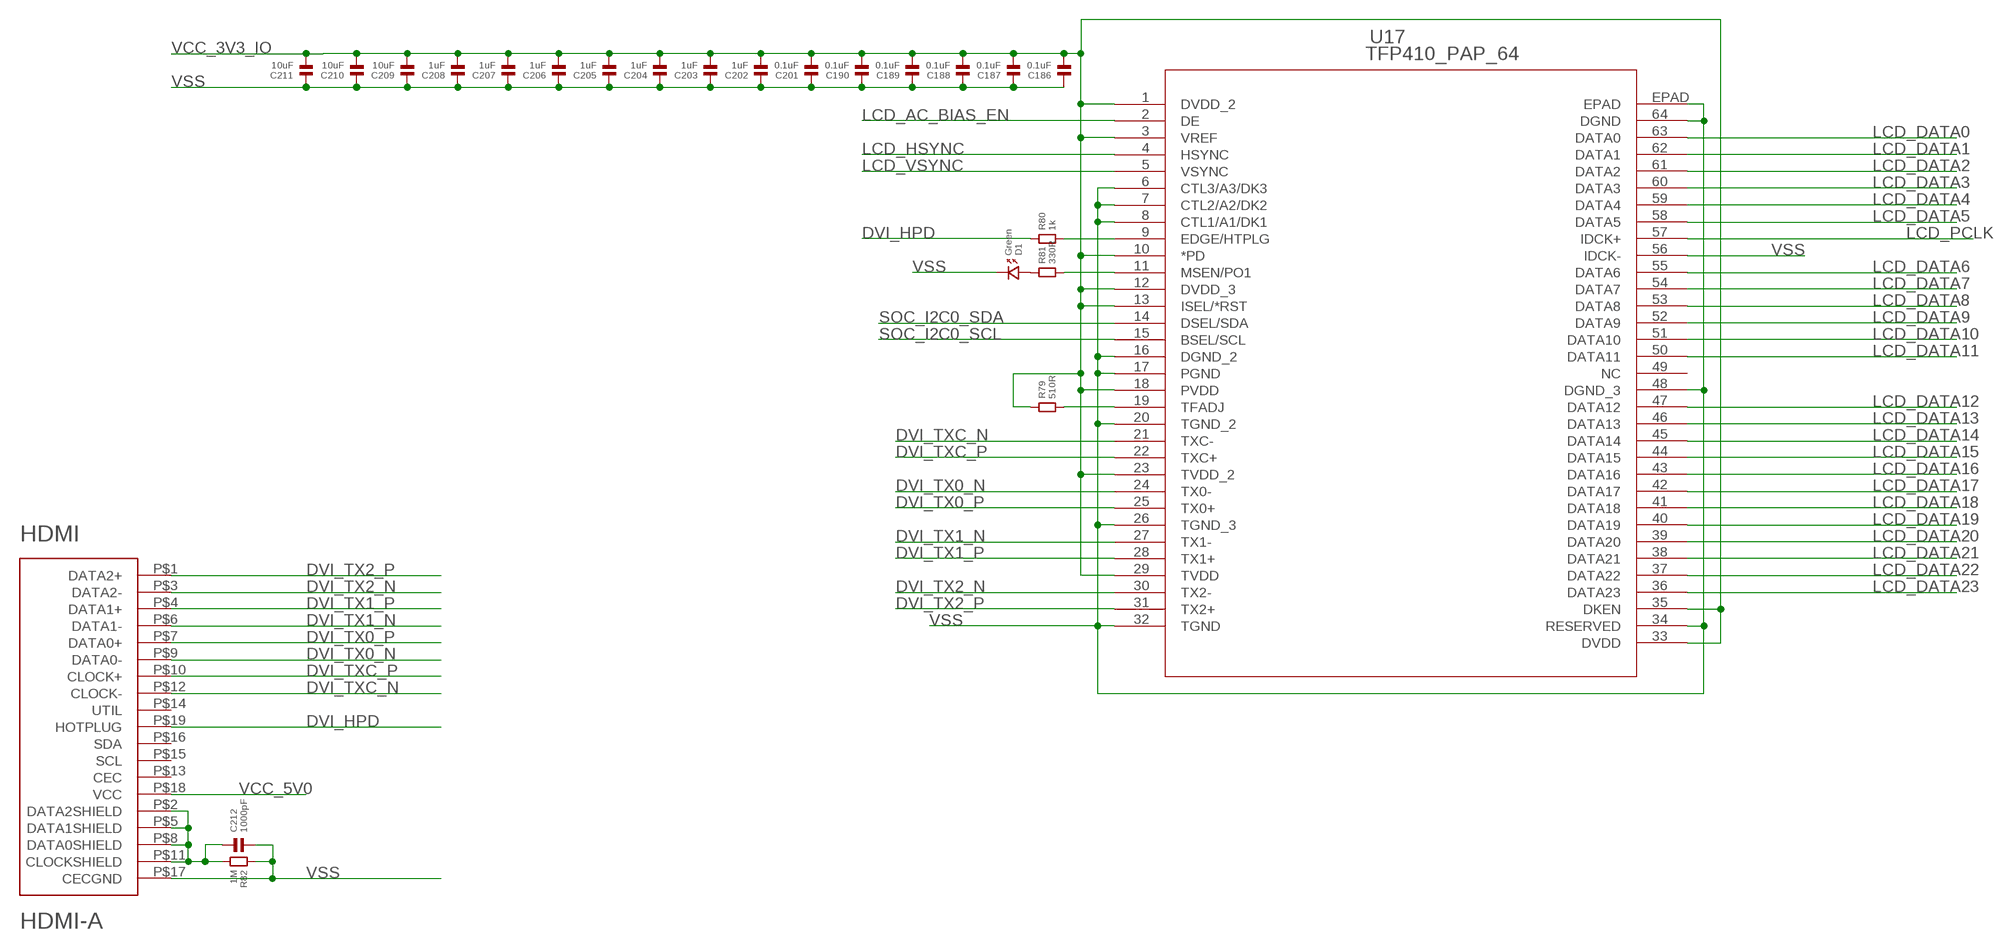
[diagram p6: schematic, sheet 6]

### Parts
C186  0.1uF  CAPACITOR.0402  [0402]
C187  0.1uF  CAPACITOR.0402  [0402]
C188  0.1uF  CAPACITOR.0402  [0402]
C189  0.1uF  CAPACITOR.0402  [0402]
C190  0.1uF  CAPACITOR.0402  [0402]
C201  0.1uF  CAPACITOR.0402  [0402]
C202  1uF  CAPACITOR.0402  [0402]
C203  1uF  CAPACITOR.0402  [0402]
C204  1uF  CAPACITOR.0402  [0402]
C205  1uF  CAPACITOR.0402  [0402]
C206  1uF  CAPACITOR.0402  [0402]
C207  1uF  CAPACITOR.0402  [0402]
C208  1uF  CAPACITOR.0402  [0402]
C209  10uF  CAPACITOR.0603  [0603]
C210  10uF  CAPACITOR.0603  [0603]
C211  10uF  CAPACITOR.0603  [0603]
C212  1000pF  CAPACITOR.0402  [0402]
D1  Green  LED.0603  [0603.LED]
HDMI  HDMI-A  [HDMI_A]
R79  510R  RESISTOR.0402  [0402]
R80  1k  RESISTOR.0402  [0402]
R81  330R  RESISTOR.0402  [0402]
R82  1M  RESISTOR.0402  [0402]
U17  TFP410_PAP_64  [PAP64_5X5]

### Nets
DVI_HPD: HDMI.P$19(HOTPLUG) R80.1
DVI_TX0_N [5mil]: HDMI.P$9(DATA0-) U17.24(TX0-)
DVI_TX0_P [5mil]: HDMI.P$7(DATA0+) U17.25(TX0+)
DVI_TX1_N [5mil]: HDMI.P$6(DATA1-) U17.27(TX1-)
DVI_TX1_P [5mil]: HDMI.P$4(DATA1+) U17.28(TX1+)
DVI_TX2_N [5mil]: HDMI.P$3(DATA2-) U17.30(TX2-)
DVI_TX2_P [5mil]: HDMI.P$1(DATA2+) U17.31(TX2+)
DVI_TXC_N [5mil]: HDMI.P$12(CLOCK-) U17.21(TXC-)
DVI_TXC_P [5mil]: HDMI.P$10(CLOCK+) U17.22(TXC+)
LCD_AC_BIAS_EN: U17.2(DE) ; also sheet 1
LCD_DATA0: U17.63(DATA0) ; also sheet 1
LCD_DATA1: U17.62(DATA1) ; also sheet 1
LCD_DATA2: U17.61(DATA2) ; also sheet 1
LCD_DATA3: U17.60(DATA3) ; also sheet 1
LCD_DATA4: U17.59(DATA4) ; also sheet 1
LCD_DATA5: U17.58(DATA5) ; also sheet 1
LCD_DATA6: U17.55(DATA6) ; also sheet 1
LCD_DATA7: U17.54(DATA7) ; also sheet 1
LCD_DATA8: U17.53(DATA8) ; also sheet 1
LCD_DATA9: U17.52(DATA9) ; also sheet 1
LCD_DATA10: U17.51(DATA10) ; also sheet 1
LCD_DATA11: U17.50(DATA11) ; also sheet 1
LCD_DATA12: U17.47(DATA12) ; also sheet 1
LCD_DATA13: U17.46(DATA13) ; also sheet 1
LCD_DATA14: U17.45(DATA14) ; also sheet 1
LCD_DATA15: U17.44(DATA15) ; also sheet 1
LCD_DATA16: U17.43(DATA16) ; also sheet 1
LCD_DATA17: U17.42(DATA17) ; also sheet 1
LCD_DATA18: U17.41(DATA18) ; also sheet 1
LCD_DATA19: U17.40(DATA19) ; also sheet 1
LCD_DATA20: U17.39(DATA20) ; also sheet 1
LCD_DATA21: U17.38(DATA21) ; also sheet 1
LCD_DATA22: U17.37(DATA22) ; also sheet 1
LCD_DATA23: U17.36(DATA23) ; also sheet 1
LCD_HSYNC: U17.4(HSYNC) ; also sheet 1
LCD_PCLK: U17.57(IDCK+) ; also sheet 1
LCD_VSYNC: U17.5(VSYNC) ; also sheet 1
N$47: R79.2 U17.19(TFADJ)
N$48: R80.2 U17.9(EDGE/HTPLG)
N$49: R81.2 U17.11(MSEN/PO1)
N$50: D1.P$1 R81.1
N$51: C212.1 HDMI.P$2(DATA2SHIELD) HDMI.P$5(DATA1SHIELD) HDMI.P$8(DATA0SHIELD) HDMI.P$11(CLOCKSHIELD) R82.2
SOC_I2C0_SCL: U17.15(BSEL/SCL) ; also sheet 1,7,9,10,12
SOC_I2C0_SDA: U17.14(DSEL/SDA) ; also sheet 1,7,9,10,12
VCC_3V3_IO: C186.2 C187.2 C188.2 C189.2 C190.2 C201.2 C202.2 C203.2 C204.2 C205.2 C206.2 C207.2 C208.2 C209.2 C210.2 C211.2 R79.1 U17.1(DVDD_2) U17.3(VREF) U17.10(*PD) U17.12(DVDD_3) U17.13(ISEL/*RST) U17.18(PVDD) U17.23(TVDD_2) U17.29(TVDD) U17.33(DVDD) U17.35(DKEN) ; also sheet 1,2,4,5,7,8,9,10,11,12,13
VCC_5V0: HDMI.P$18(VCC) ; also sheet 1,5,9,13
VSS: C186.1 C187.1 C188.1 C189.1 C190.1 C201.1 C202.1 C203.1 C204.1 C205.1 C206.1 C207.1 C208.1 C209.1 C210.1 C211.1 C212.2 D1.P$2 HDMI.P$17(CECGND) R82.1 U17.6(CTL3/A3/DK3) U17.7(CTL2/A2/DK2) U17.8(CTL1/A1/DK1) U17.16(DGND_2) U17.17(PGND) U17.20(TGND_2) U17.26(TGND_3) U17.32(TGND) U17.34(RESERVED) U17.48(DGND_3) U17.56(IDCK-) U17.64(DGND) U17.EPAD ; also sheet 1,2,3,4,5,7,8,9,10,11,12,13
Unconnected: HDMI.P$13(CEC) HDMI.P$14(UTIL) HDMI.P$15(SCL) HDMI.P$16(SDA) U17.49(NC)

## Sheet 7 of 13: PWM module
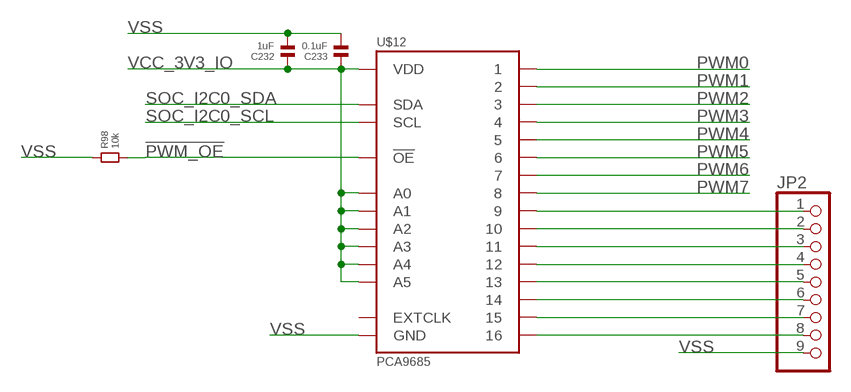
[diagram p7: schematic, sheet 7]

### Parts
C232  1uF  CAPACITOR.0402  [0402]
C233  0.1uF  CAPACITOR.0402  [0402]
JP2  PINHD-1X9  [1X09]
R98  10k  RESISTOR.0402  [0402]
U$12  PCA9685  [HVQFN28]

### Nets
!PWM_OE: R98.2 U$12.23(!OE)
N$46: JP2.1 U$12.15
N$52: JP2.2 U$12.16
N$53: JP2.3 U$12.17
N$62: JP2.5 U$12.19
N$63: JP2.4 U$12.18
N$64: JP2.6 U$12.20
N$65: JP2.7 U$12.21
N$66: JP2.8 U$12.22
PWM0: U$12.6 ; also sheet 13
PWM1: U$12.7 ; also sheet 13
PWM2: U$12.8 ; also sheet 13
PWM3: U$12.9 ; also sheet 13
PWM4: U$12.10 ; also sheet 13
PWM5: U$12.11 ; also sheet 13
PWM6: U$12.12 ; also sheet 13
PWM7: U$12.13 ; also sheet 13
SOC_I2C0_SCL: U$12.26(SCL) ; also sheet 1,6,9,10,12
SOC_I2C0_SDA: U$12.27(SDA) ; also sheet 1,6,9,10,12
VCC_3V3_IO: C232.1 C233.1 U$12.1(A0) U$12.2(A1) U$12.3(A2) U$12.4(A3) U$12.5(A4) U$12.24(A5) U$12.28(VDD) ; also sheet 1,2,4,5,6,8,9,10,11,12,13
VSS: C232.2 C233.2 JP2.9 R98.1 U$12.14(GND) U$12.PAD(GND) ; also sheet 1,2,3,4,5,6,8,9,10,11,12,13
Unconnected: U$12.25(EXTCLK)

## Sheet 8 of 13: Storage
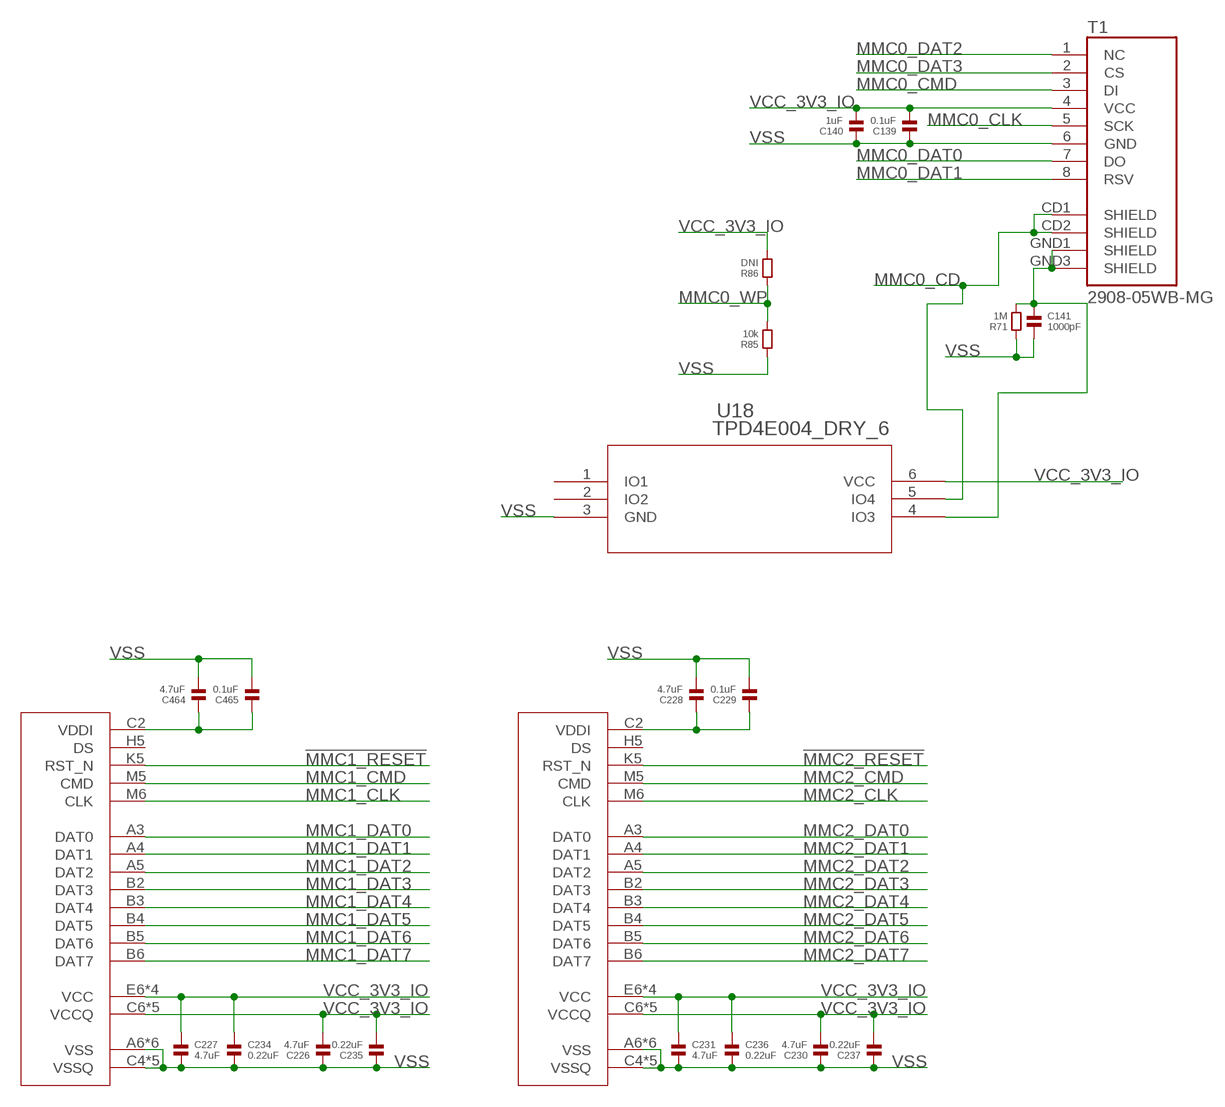
[diagram p8: schematic, sheet 8]

### Parts
C139  0.1uF  CAPACITOR.0402  [0402]
C140  1uF  CAPACITOR.0402  [0402]
C141  1000pF  CAPACITOR.0402  [0402]
C226  4.7uF  CAPACITOR.0603  [0603]
C227  4.7uF  CAPACITOR.0603  [0603]
C228  4.7uF  CAPACITOR.0603  [0603]
C229  0.1uF  CAPACITOR.0603  [0603]
C230  4.7uF  CAPACITOR.0603  [0603]
C231  4.7uF  CAPACITOR.0603  [0603]
C234  0.22uF  CAPACITOR.0603  [0603]
C235  0.22uF  CAPACITOR.0603  [0603]
C236  0.22uF  CAPACITOR.0603  [0603]
C237  0.22uF  CAPACITOR.0603  [0603]
C464  4.7uF  CAPACITOR.0603  [0603]
C465  0.1uF  CAPACITOR.0603  [0603]
R71  1M  RESISTOR.0402  [0402]
R85  10k  RESISTOR.0402  [0402]
R86  DNI  RESISTOR.0402  [0402]
T1  2908-05WB-MG  [MICRO-SD-SOCKET-PP]
U18  TPD4E004_DRY_6  [DRY6]
U$10  IS21ES16G  [BGA153C50P14X14_1150X1300X100N]
U$11  IS21ES16G  [BGA153C50P14X14_1150X1300X100N]

### Nets
!MMC1_RESET: U$10.K5(RST_N) ; also sheet 12
!MMC2_RESET: U$11.K5(RST_N) ; also sheet 12
MMC0_CD: T1.CD1(SHIELD) T1.CD2(SHIELD) U18.5(IO4) ; also sheet 1
MMC0_CLK: T1.5(SCK) ; also sheet 1
MMC0_CMD: T1.3(DI) ; also sheet 1
MMC0_DAT0: T1.7(DO) ; also sheet 1
MMC0_DAT1: T1.8(RSV) ; also sheet 1
MMC0_DAT2: T1.1(NC) ; also sheet 1
MMC0_DAT3: T1.2(CS) ; also sheet 1
MMC0_WP: R85.2 R86.1 ; also sheet 1
MMC1_CLK: U$10.M6(CLK) ; also sheet 1
MMC1_CMD: U$10.M5(CMD) ; also sheet 1
MMC1_DAT0: U$10.A3(DAT0) ; also sheet 1
MMC1_DAT1: U$10.A4(DAT1) ; also sheet 1
MMC1_DAT2: U$10.A5(DAT2) ; also sheet 1
MMC1_DAT3: U$10.B2(DAT3) ; also sheet 1
MMC1_DAT4: U$10.B3(DAT4) ; also sheet 1
MMC1_DAT5: U$10.B4(DAT5) ; also sheet 1
MMC1_DAT6: U$10.B5(DAT6) ; also sheet 1
MMC1_DAT7: U$10.B6(DAT7) ; also sheet 1
MMC2_CLK: U$11.M6(CLK) ; also sheet 1
MMC2_CMD: U$11.M5(CMD) ; also sheet 1
MMC2_DAT0: U$11.A3(DAT0) ; also sheet 1
MMC2_DAT1: U$11.A4(DAT1) ; also sheet 1
MMC2_DAT2: U$11.A5(DAT2) ; also sheet 1
MMC2_DAT3: U$11.B2(DAT3) ; also sheet 1
MMC2_DAT4: U$11.B3(DAT4) ; also sheet 1
MMC2_DAT5: U$11.B4(DAT5) ; also sheet 1
MMC2_DAT6: U$11.B5(DAT6) ; also sheet 1
MMC2_DAT7: U$11.B6(DAT7) ; also sheet 1
N$17: C141.1 R71.2 T1.GND1(SHIELD) T1.GND3(SHIELD) U18.4(IO3)
N$39: C464.1 C465.1 U$10.C2(VDDI)
N$44: C228.1 C229.1 U$11.C2(VDDI)
VCC_3V3_IO: C139.2 C140.2 C226.2 C227.1 C230.2 C231.1 C234.1 C235.2 C236.1 C237.2 R86.2 T1.4(VCC) U18.6(VCC) U$10.C6(VCCQ) U$10.E6(VCC) U$10.F5(VCC) U$10.J10(VCC) U$10.K9(VCC) U$10.M4(VCCQ) U$10.N4(VCCQ) U$10.P3(VCCQ) U$10.P5(VCCQ) U$11.C6(VCCQ) U$11.E6(VCC) U$11.F5(VCC) U$11.J10(VCC) U$11.K9(VCC) U$11.M4(VCCQ) U$11.N4(VCCQ) U$11.P3(VCCQ) U$11.P5(VCCQ) ; also sheet 1,2,4,5,6,7,9,10,11,12,13
VSS: C139.1 C140.1 C141.2 C226.1 C227.2 C228.2 C229.2 C230.1 C231.2 C234.2 C235.1 C236.2 C237.1 C464.2 C465.2 R71.1 R85.1 T1.6(GND) U18.3(GND) U$10.A6(VSS) U$10.C4(VSSQ) U$10.E7(VSS) U$10.G5(VSS) U$10.H10(VSS) U$10.J5(VSS) U$10.K8(VSS) U$10.N2(VSSQ) U$10.N5(VSSQ) U$10.P4(VSSQ) U$10.P6(VSSQ) U$11.A6(VSS) U$11.C4(VSSQ) U$11.E7(VSS) U$11.G5(VSS) U$11.H10(VSS) U$11.J5(VSS) U$11.K8(VSS) U$11.N2(VSSQ) U$11.N5(VSSQ) U$11.P4(VSSQ) U$11.P6(VSSQ) ; also sheet 1,2,3,4,5,6,7,9,10,11,12,13
Unconnected: U18.1(IO1) U18.2(IO2) U$10.H5(DS) U$11.H5(DS)

## Sheet 9 of 13: Regulators
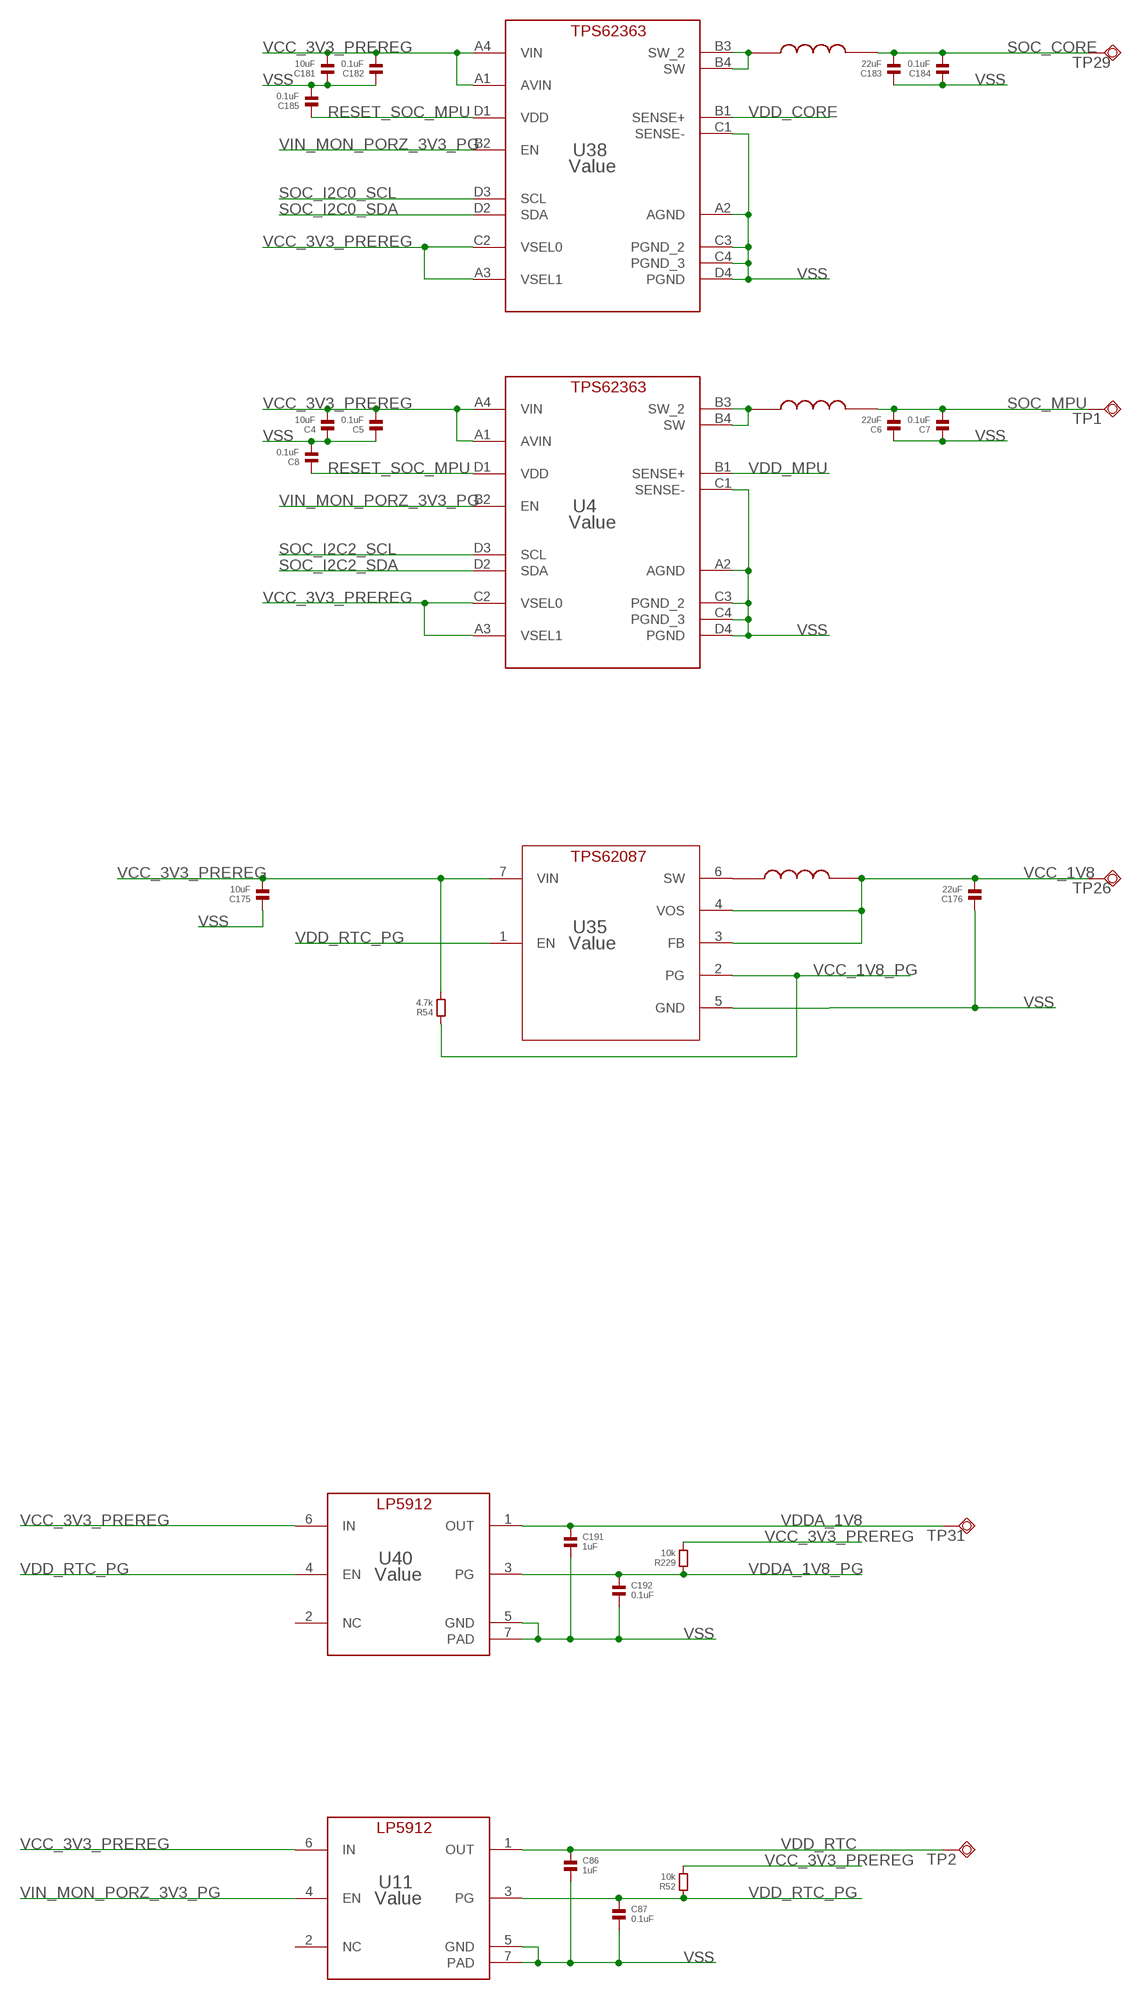
[diagram p9: schematic, sheet 9, part 1 of 2]
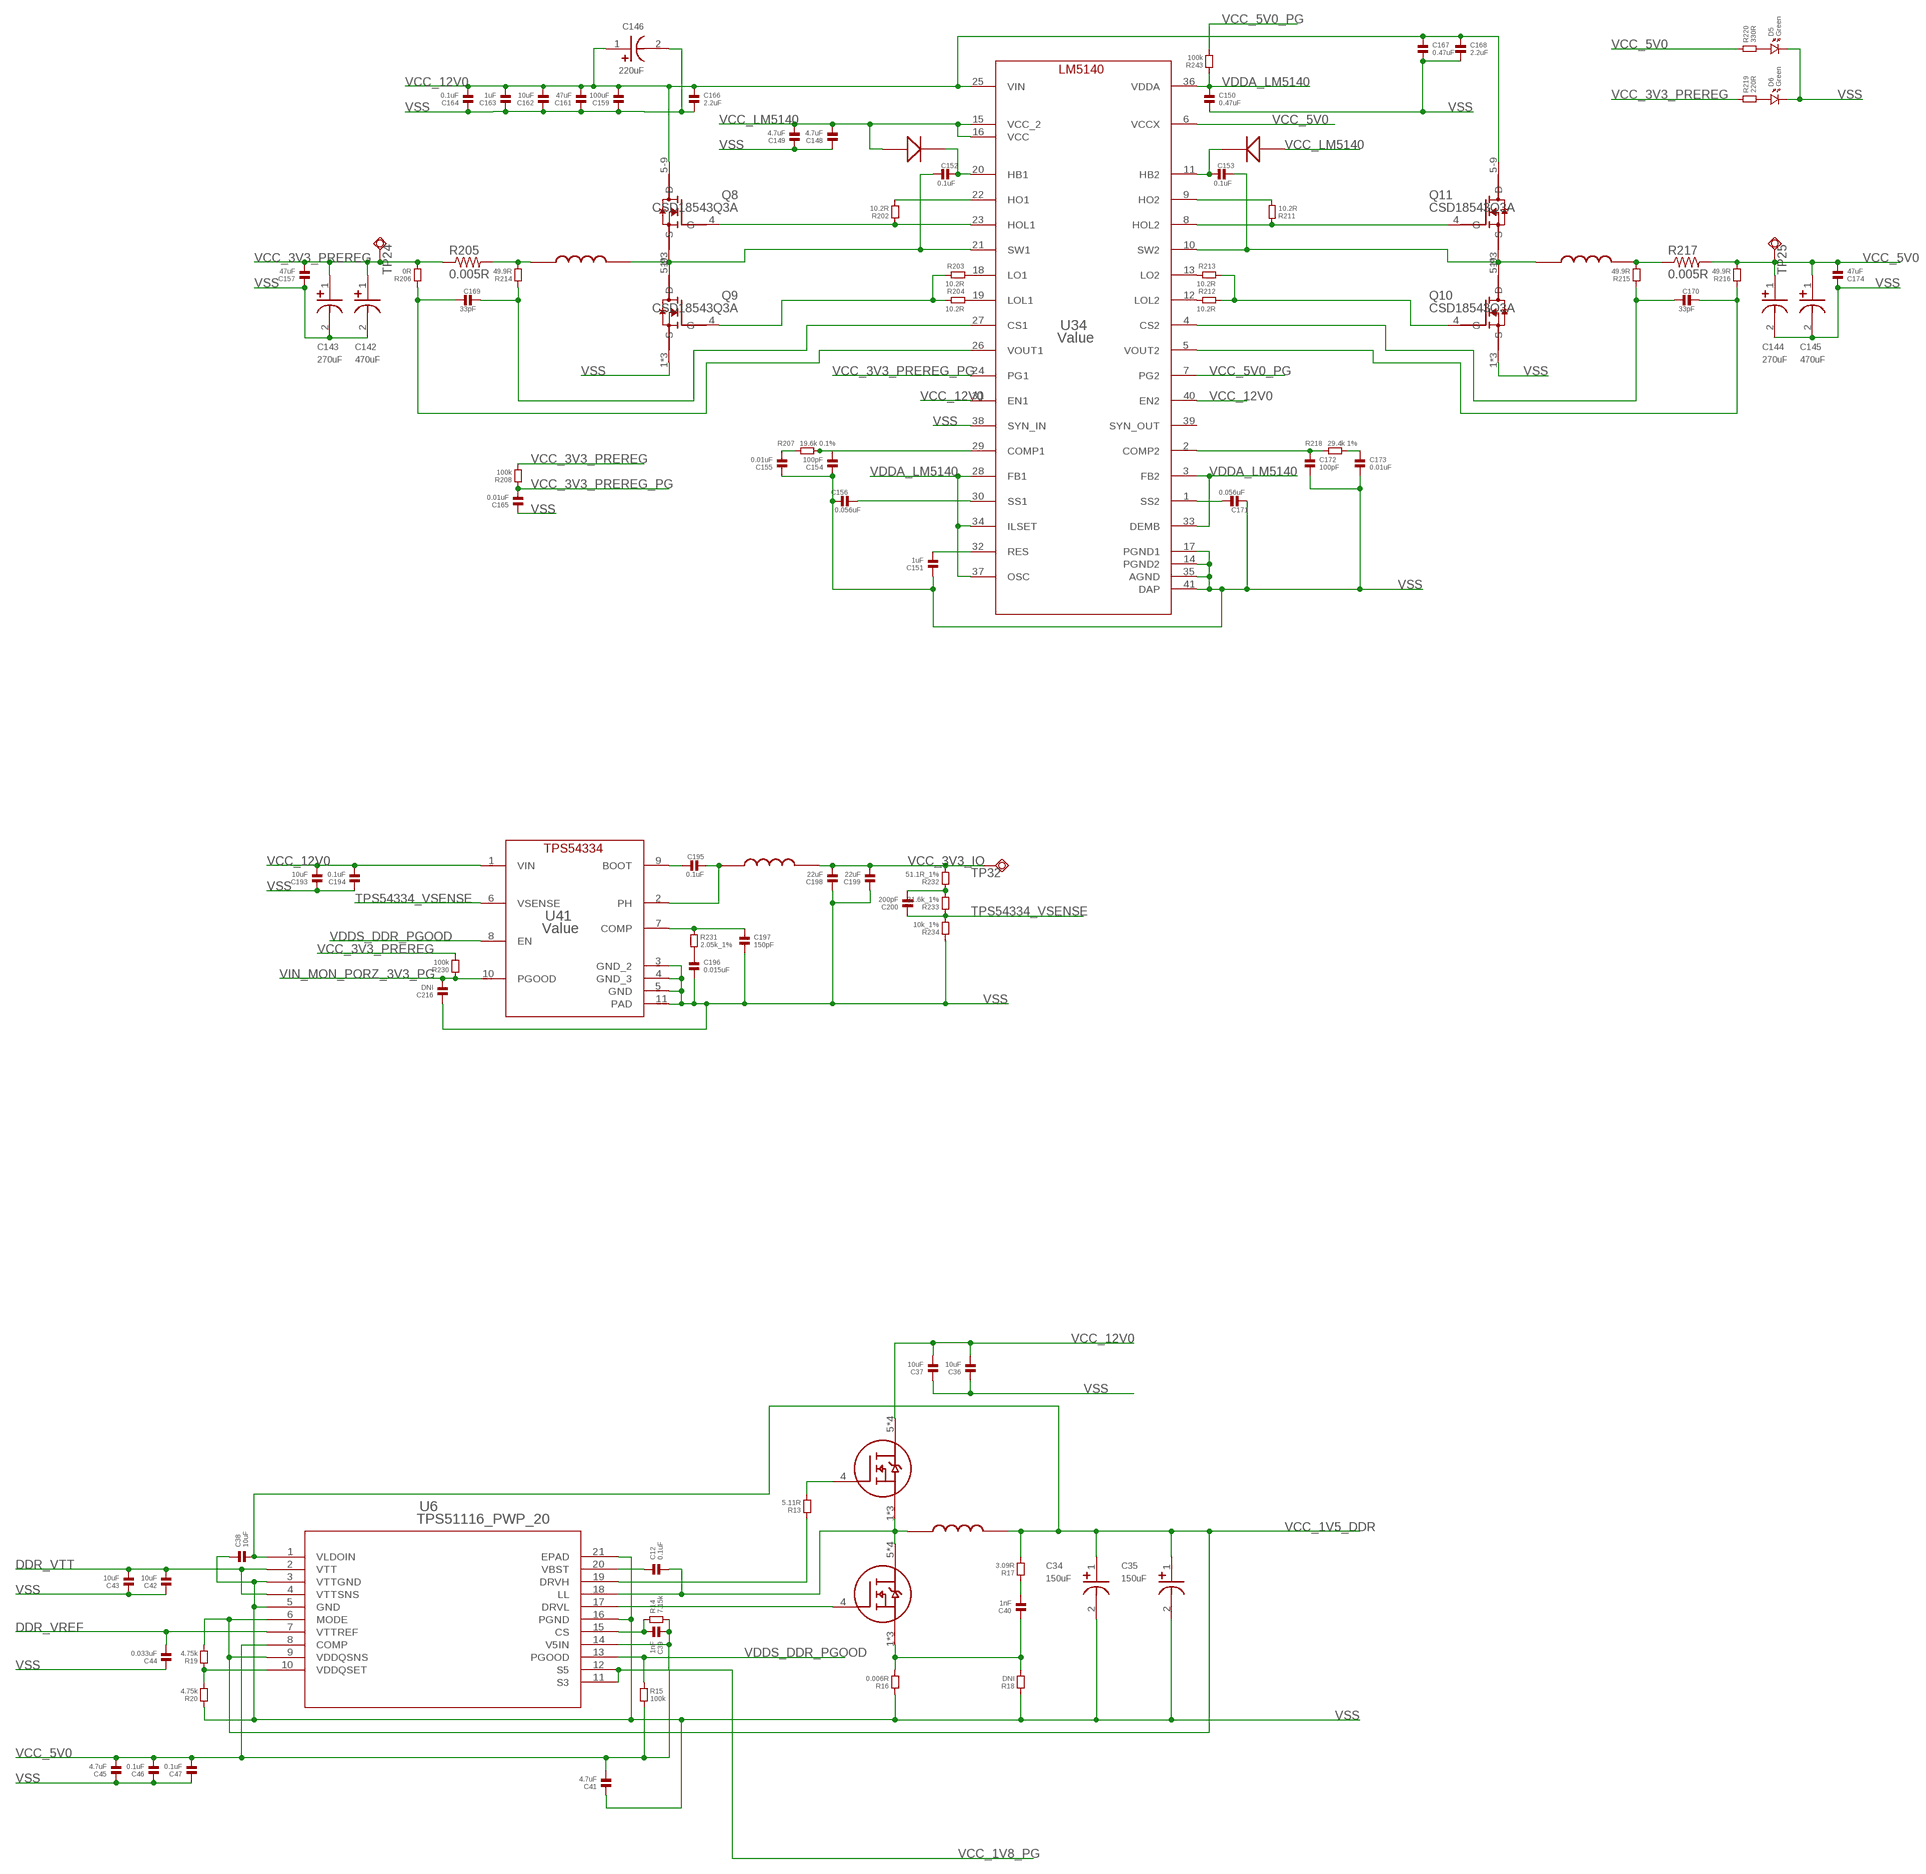
[diagram p10: schematic, sheet 9, part 2 of 2]

### Parts
C4  10uF  CAPACITOR.0603  [0603]
C5  0.1uF  CAPACITOR.0603  [0603]
C6  22uF  CAPACITOR.0603  [0603]
C7  0.1uF  CAPACITOR.0603  [0603]
C8  0.1uF  CAPACITOR.0603  [0603]
C12  0.1uF  CAPACITOR.0603  [0603]
C34  150uF  CAPACITOR_POLARIZED2  [CAPPRD350W65D800H1500B]
C35  150uF  CAPACITOR_POLARIZED2  [CAPPRD350W65D800H1500B]
C36  10uF  CAPACITOR.0603  [0603]
C37  10uF  CAPACITOR.0603  [0603]
C38  10uF  CAPACITOR.0603  [0603]
C39  1nF  CAPACITOR.0603  [0603]
C40  1nF  CAPACITOR.0603  [0603]
C41  4.7uF  CAPACITOR.0603  [0603]
C42  10uF  CAPACITOR.0603  [0603]
C43  10uF  CAPACITOR.0603  [0603]
C44  0.033uF  CAPACITOR.0603  [0603]
C45  4.7uF  CAPACITOR.0603  [0603]
C46  0.1uF  CAPACITOR.0603  [0603]
C47  0.1uF  CAPACITOR.0603  [0603]
C86  1uF  CAPACITOR.0603  [0603]
C87  0.1uF  CAPACITOR.0603  [0603]
C142  470uF  CAPACITOR_POLARIZED1  [CAPPRD300W65D800H1200B]
C143  270uF  CAPACITOR_POLARIZED2  [CAPPRD350W65D800H1500B]
C144  270uF  CAPACITOR_POLARIZED2  [CAPPRD350W65D800H1500B]
C145  470uF  CAPACITOR_POLARIZED1  [CAPPRD300W65D800H1200B]
C146  220uF  CAPACITOR_POLARIZED  [CAPPRD250W65D600H1100B]
C148  4.7uF  CAPACITOR.0603  [0603]
C149  4.7uF  CAPACITOR.0603  [0603]
C150  0.47uF  CAPACITOR.0603  [0603]
C151  1uF  CAPACITOR.0603  [0603]
C152  0.1uF  CAPACITOR.0603  [0603]
C153  0.1uF  CAPACITOR.0603  [0603]
C154  100pF  CAPACITOR.0603  [0603]
C155  0.01uF  CAPACITOR.0603  [0603]
C156  0.056uF  CAPACITOR.0603  [0603]
C157  47uF  CAPACITOR.0805  [0805]
C159  100uF  CAPACITOR.0805  [0805]
C161  47uF  CAPACITOR.0805  [0805]
C162  10uF  CAPACITOR.0603  [0603]
C163  1uF  CAPACITOR.0603  [0603]
C164  0.1uF  CAPACITOR.0603  [0603]
C165  0.01uF  CAPACITOR.0603  [0603]
C166  2.2uF  CAPACITOR.0603  [0603]
C167  0.47uF  CAPACITOR.0603  [0603]
C168  2.2uF  CAPACITOR.0603  [0603]
C169  33pF  CAPACITOR.0603  [0603]
C170  33pF  CAPACITOR.0603  [0603]
C171  0.056uF  CAPACITOR.0603  [0603]
C172  100pF  CAPACITOR.0603  [0603]
C173  0.01uF  CAPACITOR.0603  [0603]
C174  47uF  CAPACITOR.0805  [0805]
C175  10uF  CAPACITOR.0603  [0603]
C176  22uF  CAPACITOR.0603  [0603]
C181  10uF  CAPACITOR.0603  [0603]
C182  0.1uF  CAPACITOR.0603  [0603]
C183  22uF  CAPACITOR.0603  [0603]
C184  0.1uF  CAPACITOR.0603  [0603]
C185  0.1uF  CAPACITOR.0603  [0603]
C191  1uF  CAPACITOR.0603  [0603]
C192  0.1uF  CAPACITOR.0603  [0603]
C193  10uF  CAPACITOR.0805  [0805]
C194  0.1uF  CAPACITOR.0805  [0805]
C195  0.1uF  CAPACITOR.0603  [0603]
C196  0.015uF  CAPACITOR.0603  [0603]
C197  150pF  CAPACITOR.0603  [0603]
C198  22uF  CAPACITOR.0603  [0603]
C199  22uF  CAPACITOR.0603  [0603]
C200  200pF  CAPACITOR.0603  [0603]
C216  DNI  CAPACITOR.0603  [0603]
D5  Green  LED.0603  [0603.LED]
D6  Green  LED.0603  [0603.LED]
Q8  CSD18543Q3A  [SON65P300X315X90-9N]
Q9  CSD18543Q3A  [SON65P300X315X90-9N]
Q10  CSD18543Q3A  [SON65P300X315X90-9N]
Q11  CSD18543Q3A  [SON65P300X315X90-9N]
R13  5.11R  RESISTOR.0603  [0603]
R14  7.15k  RESISTOR.0603  [0603]
R15  100k  RESISTOR.0603  [0603]
R16  0.006R  RESISTOR.0805  [0805]
R17  3.09R  RESISTOR.0603  [0603]
R18  DNI  RESISTOR.0603  [0603]
R19  4.75k  RESISTOR.0603  [0603]
R20  4.75k  RESISTOR.0603  [0603]
R52  10k  RESISTOR.0603  [0603]
R54  4.7k  RESISTOR.0603  [0603]
R202  10.2R  RESISTOR.0603  [0603]
R203  10.2R  RESISTOR.0603  [0603]
R204  10.2R  RESISTOR.0603  [0603]
R205  0.005R  R-US_R2512  [R2512]
R206  0R  RESISTOR.0603  [0603]
R207  19.6k 0.1%  RESISTOR.0603  [0603]
R208  100k  RESISTOR.0603  [0603]
R211  10.2R  RESISTOR.0603  [0603]
R212  10.2R  RESISTOR.0603  [0603]
R213  10.2R  RESISTOR.0603  [0603]
R214  49.9R  RESISTOR.0603  [0603]
R215  49.9R  RESISTOR.0603  [0603]
R216  49.9R  RESISTOR.0603  [0603]
R217  0.005R  R-US_R2512  [R2512]
R218  29.4k 1%  RESISTOR.0603  [0603]
R219  220R  RESISTOR.0603  [0603]
R220  330R  RESISTOR.0603  [0603]
R229  10k  RESISTOR.0603  [0603]
R230  100k  RESISTOR.0603  [0603]
R231  2.05k_1%  RESISTOR.0603  [0603]
R232  51.1R_1%  RESISTOR.0603  [0603]
R233  31.6k_1%  RESISTOR.0603  [0603]
R234  10k_1%  RESISTOR.0603  [0603]
R243  100k  RESISTOR.0603  [0603]
TP1  TESTPAD_TPSQB1,27  [TESTPAD_B1,27]
TP2  TESTPAD_TPSQB1,27  [TESTPAD_B1,27]
TP24  TESTPAD_TPSQB1,27  [TESTPAD_B1,27]
TP25  TESTPAD_TPSQB1,27  [TESTPAD_B1,27]
TP26  TESTPAD_TPSQB1,27  [TESTPAD_B1,27]
TP29  TESTPAD_TPSQB1,27  [TESTPAD_B1,27]
TP31  TESTPAD_TPSQB1,27  [TESTPAD_B1,27]
TP32  TESTPAD_TPSQB1,27  [TESTPAD_B1,27]
U4  Value  TPS62363YZHR  [YZH0016AFAF]
U6  TPS51116_PWP_20  [PWP20_3P4X2P4]
U11  Value  LP5912-1.1DRVR  [DRV0006A]
U34  Value  LM5140QRWGRQ1  [RWG0040A]
U35  Value  TPS62087RLTR  [RLT0007A]
U38  Value  TPS62363YZHR  [YZH0016AFAF]
U40  Value  LP5912-1.1DRVR  [DRV0006A]
U41  Value  TPS54334DRCR  [DRC0010J]
U$1  XFL4015-471MEB  [XFL4015-471MEB]
U$2  IRF7821  [SOIC127P600X175-8_V2]
U$3  IRF7832  [SOIC127P600X175-8_V2]
U$4  XFL4020-102MEB  [XFL4020-102MEB]
U$20  DB2441700L  [DB2441700L]
U$21  DB2441700L  [DB2441700L]
U$22  XEL6030-152MEB  [XEL6030-152MEB]
U$25  XEL6030-152MEB  [XEL6030-152MEB]
U$28  XFL4015-471MEB  [XFL4015-471MEB]
U$30  XFL4015-471MEB  [XFL4015-471MEB]
U$33  XEL4030-682ME_  [XEL4030-682ME_]

### Nets
DDR_VREF: C44.2 U6.7(VTTREF) ; also sheet 1,3
DDR_VTT: C42.2 C43.2 U6.2(VTT) U6.4(VTTSNS) ; also sheet 3
N$3: U4.B3(SW_2) U4.B4(SW) U$1.P$1
N$18: R19.1 R20.2 U6.10(VDDQSET)
N$19: C12.1 U6.20(VBST)
N$27: U6.17(DRVL) U$3.4(GATE)
N$28: R13.1 U6.19(DRVH)
N$29: R13.2 U$2.4(GATE)
N$30: C12.2 U6.18(LL) U$2.1(SOURCE) U$2.2(SOURCE) U$2.3(SOURCE) U$3.5(DRAIN) U$3.6(DRAIN) U$3.7(DRAIN) U$3.8(DRAIN) U$4.V
N$31: C39.2 R14.1 U6.15(CS)
N$33: C40.1 R16.2 R18.2 U$3.1(SOURCE) U$3.2(SOURCE) U$3.3(SOURCE)
N$35: C40.2 R17.1
N$159: C151.2 U34.32(RES)
N$162: C152.1 U34.20(HB1) U$21.CATHODE
N$163: C153.2 U34.11(HB2) U$20.CATHODE
N$164: C152.2 Q8.1(S) Q8.2(S) Q8.3(S) Q9.5-9(D) U34.21(SW1) U$22.P$2
N$165: Q8.4(G) R202.1 U34.23(HOL1)
N$166: R202.2 U34.22(HO1)
N$168: Q9.4(G) R203.1 R204.1
N$169: R203.2 U34.18(LO1)
N$170: R204.2 U34.19(LOL1)
N$171: R205.2 R214.2 U$22.P$1
N$172: C169.1 R214.1 U34.27(CS1)
N$173: C169.2 R206.1 U34.26(VOUT1)
N$174: C154.2 R207.2 U34.29(COMP1)
N$175: C155.2 R207.1
N$176: C156.2 U34.30(SS1)
N$177: C153.1 Q10.5-9(D) Q11.1(S) Q11.2(S) Q11.3(S) U34.10(SW2) U$25.P$1
N$178: Q11.4(G) R211.1 U34.8(HOL2)
N$179: R211.2 U34.9(HO2)
N$180: R212.1 U34.12(LOL2)
N$181: R213.1 U34.13(LO2)
N$182: Q10.4(G) R212.2 R213.2
N$183: R215.2 R217.1 U$25.P$2
N$184: C170.2 R215.1 U34.4(CS2)
N$185: C170.1 R216.1 U34.5(VOUT2)
N$186: C171.2 U34.1(SS2)
N$187: C173.1 R218.2
N$188: C172.1 R218.1 U34.2(COMP2)
N$189: D6.P$1 R219.2
N$190: D5.P$1 R220.2
N$191: U35.6(SW) U$28.P$1
N$196: U38.B3(SW_2) U38.B4(SW) U$30.P$1
N$203: C195.2 U41.2(PH) U$33.P$1
N$204: C195.1 U41.9(BOOT)
N$205: C196.1 R231.2
N$206: C197.1 R231.1 U41.7(COMP)
N$207: C200.2 R232.1 R233.2
RESET_SOC_MPU: C8.1 C185.1 U4.D1(VDD) U38.D1(VDD) ; also sheet 12
SOC_CORE: C183.2 C184.2 TP29.TP U$30.P$2 ; also sheet 10
SOC_I2C0_SCL: U38.D3(SCL) ; also sheet 1,6,7,10,12
SOC_I2C0_SDA: U38.D2(SDA) ; also sheet 1,6,7,10,12
SOC_I2C2_SCL: U4.D3(SCL) ; also sheet 1,13
SOC_I2C2_SDA: U4.D2(SDA) ; also sheet 1,13
SOC_MPU: C6.2 C7.2 TP1.TP U$1.P$2 ; also sheet 10
TPS54334_VSENSE: C200.1 R233.1 R234.2 U41.6(VSENSE)
VCC_1V5_DDR: C34.1(+) C35.1(+) C38.2 R17.2 R19.2 U6.1(VLDOIN) U6.6(MODE) U6.9(VDDQSNS) U$4.V1 ; also sheet 10
VCC_1V8: C176.2 TP26.TP U35.3(FB) U35.4(VOS) U$28.P$2 ; also sheet 1,2
VCC_1V8_PG: R54.1 U6.11(S3) U6.12(S5) U35.2(PG)
VCC_3V3_IO: C198.2 C199.2 R232.2 TP32.TP U$33.P$2 ; also sheet 1,2,4,5,6,7,8,10,11,12,13
VCC_3V3_PREREG: C4.2 C5.2 C142.1(+) C143.1(+) C157.2 C175.2 C181.2 C182.2 R52.2 R54.2 R205.1 R206.2 R208.2 R219.1 R229.2 R230.2 TP24.TP U4.A1(AVIN) U4.A3(VSEL1) U4.A4(VIN) U4.C2(VSEL0) U11.6(IN) U35.7(VIN) U38.A1(AVIN) U38.A3(VSEL1) U38.A4(VIN) U38.C2(VSEL0) U40.6(IN) ; also sheet 11
VCC_3V3_PREREG_PG: C165.2 R208.1 U34.24(PG1)
VCC_5V0: C39.1 C41.2 C45.2 C46.2 C47.2 C144.1(+) C145.1(+) C174.2 R14.2 R15.2 R216.2 R217.2 R220.1 TP25.TP U6.8(COMP) U6.14(V5IN) U34.6(VCCX) ; also sheet 1,5,6,13
VCC_5V0_PG: R243.2 U34.7(PG2)
VCC_12V0: C36.2 C37.2 C146.1(+) C159.2 C161.2 C162.2 C163.2 C164.2 C166.1 C167.1 C168.1 C193.2 C194.2 Q8.5-9(D) Q11.5-9(D) U34.25(VIN) U34.31(EN1) U34.40(EN2) U41.1(VIN) U$2.5(DRAIN) U$2.6(DRAIN) U$2.7(DRAIN) U$2.8(DRAIN) ; also sheet 11,13
VCC_LM5140: C148.2 C149.2 U34.15(VCC_2) U34.16(VCC) U$20.ANODE U$21.ANODE
VDD_CORE: U38.B1(SENSE+) ; also sheet 2,10
VDD_MPU: U4.B1(SENSE+) ; also sheet 2,10,11
VDD_RTC: C86.1 TP2.TP U11.1(OUT) ; also sheet 2
VDD_RTC_PG: C87.1 R52.1 U11.3(PG) U35.1(EN) U40.4(EN)
VDDA_1V8: C191.1 TP31.TP U40.1(OUT) ; also sheet 2
VDDA_1V8_PG: C192.1 R229.1 U40.3(PG)
VDDA_LM5140: C150.1 R243.1 U34.3(FB2) U34.28(FB1) U34.33(DEMB) U34.34(ILSET) U34.36(VDDA) U34.37(OSC)
VDDS_DDR_PGOOD: R15.1 U6.13(PGOOD) U41.8(EN)
VIN_MON_PORZ_3V3_PG: C216.2 R230.1 U4.B2(EN) U11.4(EN) U38.B2(EN) U41.10(PGOOD) ; also sheet 1,11
VSS: C4.1 C5.1 C6.1 C7.1 C8.2 C34.2(-) C35.2(-) C36.1 C37.1 C38.1 C41.1 C42.1 C43.1 C44.1 C45.1 C46.1 C47.1 C86.2 C87.2 C142.2(-) C143.2(-) C144.2(-) C145.2(-) C146.2(-) C148.1 C149.1 C150.2 C151.1 C154.1 C155.1 C156.1 C157.1 C159.1 C161.1 C162.1 C163.1 C164.1 C165.1 C166.2 C167.2 C168.2 C171.1 C172.2 C173.2 C174.1 C175.1 C176.1 C181.1 C182.1 C183.1 C184.1 C185.2 C191.2 C192.2 C193.1 C194.1 C196.2 C197.2 C198.1 C199.1 C216.1 D5.P$2 D6.P$2 Q9.1(S) Q9.2(S) Q9.3(S) Q10.1(S) Q10.2(S) Q10.3(S) R16.1 R18.1 R20.1 R234.1 U4.A2(AGND) U4.C1(SENSE-) U4.C3(PGND_2) U4.C4(PGND_3) U4.D4(PGND) U6.3(VTTGND) U6.5(GND) U6.16(PGND) U6.21(EPAD) U11.5(GND) U11.7(PAD) U34.14(PGND2) U34.17(PGND1) U34.35(AGND) U34.38(SYN_IN) U34.41(DAP) U35.5(GND) U38.A2(AGND) U38.C1(SENSE-) U38.C3(PGND_2) U38.C4(PGND_3) U38.D4(PGND) U40.5(GND) U40.7(PAD) U41.3(GND_2) U41.4(GND_3) U41.5(GND) U41.11(PAD) ; also sheet 1,2,3,4,5,6,7,8,10,11,12,13
Unconnected: U11.2(NC) U34.39(SYN_OUT) U40.2(NC)

### Notes on the sheet
- LM5140
- TPS62363
- TPS62363
- TPS62087
- TPS54334
- LP5912
- LP5912

## Sheet 10 of 13: Current monitoring
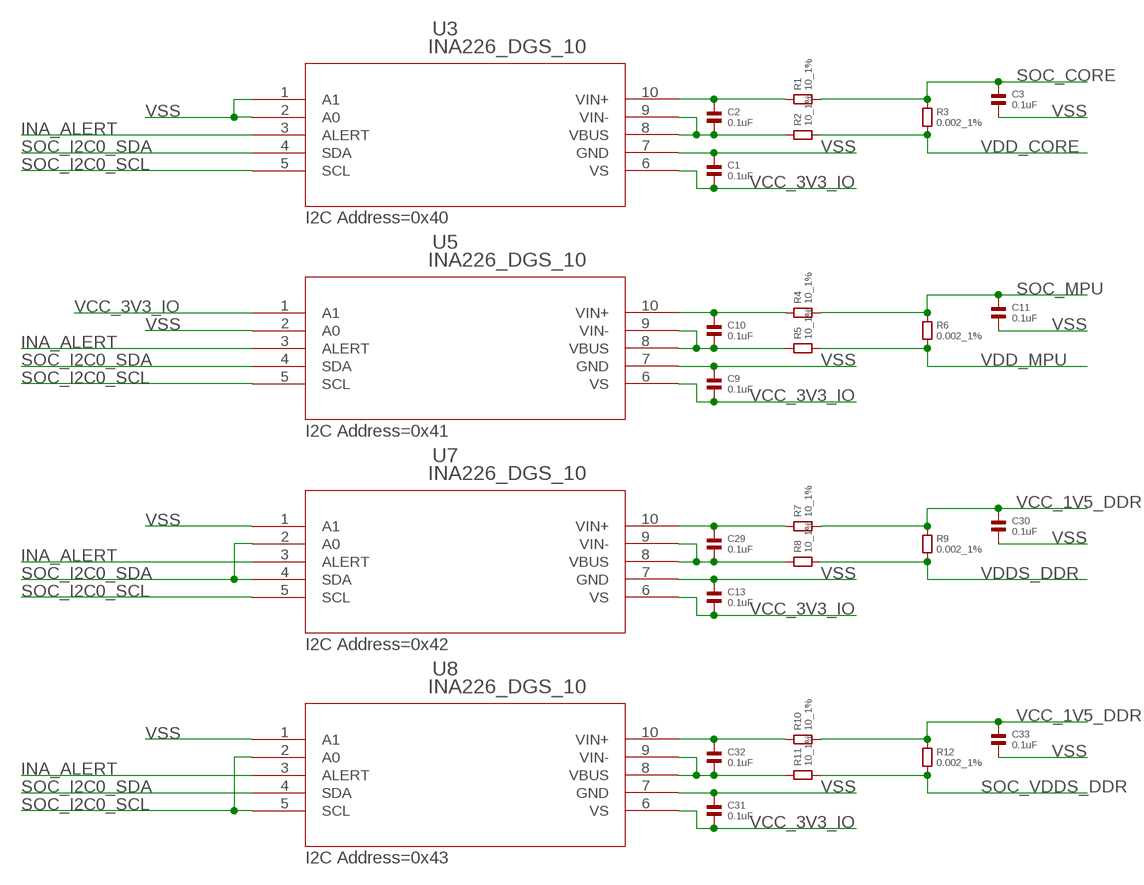
[diagram p11: schematic, sheet 10]

### Parts
C1  0.1uF  CAPACITOR.0603  [0603]
C2  0.1uF  CAPACITOR.0603  [0603]
C3  0.1uF  CAPACITOR.0603  [0603]
C9  0.1uF  CAPACITOR.0603  [0603]
C10  0.1uF  CAPACITOR.0603  [0603]
C11  0.1uF  CAPACITOR.0603  [0603]
C13  0.1uF  CAPACITOR.0603  [0603]
C29  0.1uF  CAPACITOR.0603  [0603]
C30  0.1uF  CAPACITOR.0603  [0603]
C31  0.1uF  CAPACITOR.0603  [0603]
C32  0.1uF  CAPACITOR.0603  [0603]
C33  0.1uF  CAPACITOR.0603  [0603]
R1  10_1%  RESISTOR.0603  [0603]
R2  10_1%  RESISTOR.0603  [0603]
R3  0.002_1%  RESISTOR.1206  [1206]
R4  10_1%  RESISTOR.0603  [0603]
R5  10_1%  RESISTOR.0603  [0603]
R6  0.002_1%  RESISTOR.1206  [1206]
R7  10_1%  RESISTOR.0603  [0603]
R8  10_1%  RESISTOR.0603  [0603]
R9  0.002_1%  RESISTOR.1206  [1206]
R10  10_1%  RESISTOR.0603  [0603]
R11  10_1%  RESISTOR.0603  [0603]
R12  0.002_1%  RESISTOR.1206  [1206]
U3  INA226_DGS_10  [DGS10]
U5  INA226_DGS_10  [DGS10]
U7  INA226_DGS_10  [DGS10]
U8  INA226_DGS_10  [DGS10]

### Nets
INA_ALERT: U3.3(ALERT) U5.3(ALERT) U7.3(ALERT) U8.3(ALERT) ; also sheet 12
N$1: C2.2 R2.1 U3.8(VBUS) U3.9(VIN-)
N$2: C2.1 R1.1 U3.10(VIN+)
N$4: C10.2 R5.1 U5.8(VBUS) U5.9(VIN-)
N$5: C10.1 R4.1 U5.10(VIN+)
N$20: C29.2 R8.1 U7.8(VBUS) U7.9(VIN-)
N$22: C29.1 R7.1 U7.10(VIN+)
N$23: C32.2 R11.1 U8.8(VBUS) U8.9(VIN-)
N$24: C32.1 R10.1 U8.10(VIN+)
SOC_CORE: C3.1 R1.2 R3.1 ; also sheet 9
SOC_I2C0_SCL: U3.5(SCL) U5.5(SCL) U7.5(SCL) U8.2(A0) U8.5(SCL) ; also sheet 1,6,7,9,12
SOC_I2C0_SDA: U3.4(SDA) U5.4(SDA) U7.2(A0) U7.4(SDA) U8.4(SDA) ; also sheet 1,6,7,9,12
SOC_MPU: C11.1 R4.2 R6.1 ; also sheet 9
SOC_VDDS_DDR: R11.2 R12.2 ; also sheet 2
VCC_1V5_DDR: C30.1 C33.1 R7.2 R9.1 R10.2 R12.1 ; also sheet 9
VCC_3V3_IO: C1.2 C9.2 C13.2 C31.2 U3.6(VS) U5.1(A1) U5.6(VS) U7.6(VS) U8.6(VS) ; also sheet 1,2,4,5,6,7,8,9,11,12,13
VDD_CORE: R2.2 R3.2 ; also sheet 2,9
VDD_MPU: R5.2 R6.2 ; also sheet 2,9,11
VDDS_DDR: R8.2 R9.2 ; also sheet 3
VSS: C1.1 C3.2 C9.1 C11.2 C13.1 C30.2 C31.1 C33.2 U3.1(A1) U3.2(A0) U3.7(GND) U5.2(A0) U5.7(GND) U7.1(A1) U7.7(GND) U8.1(A1) U8.7(GND) ; also sheet 1,2,3,4,5,6,7,8,9,11,12,13

### Notes on the sheet
- I2C Address=0x40
- I2C Address=0x41
- I2C Address=0x42
- I2C Address=0x43

## Sheet 11 of 13: Reset
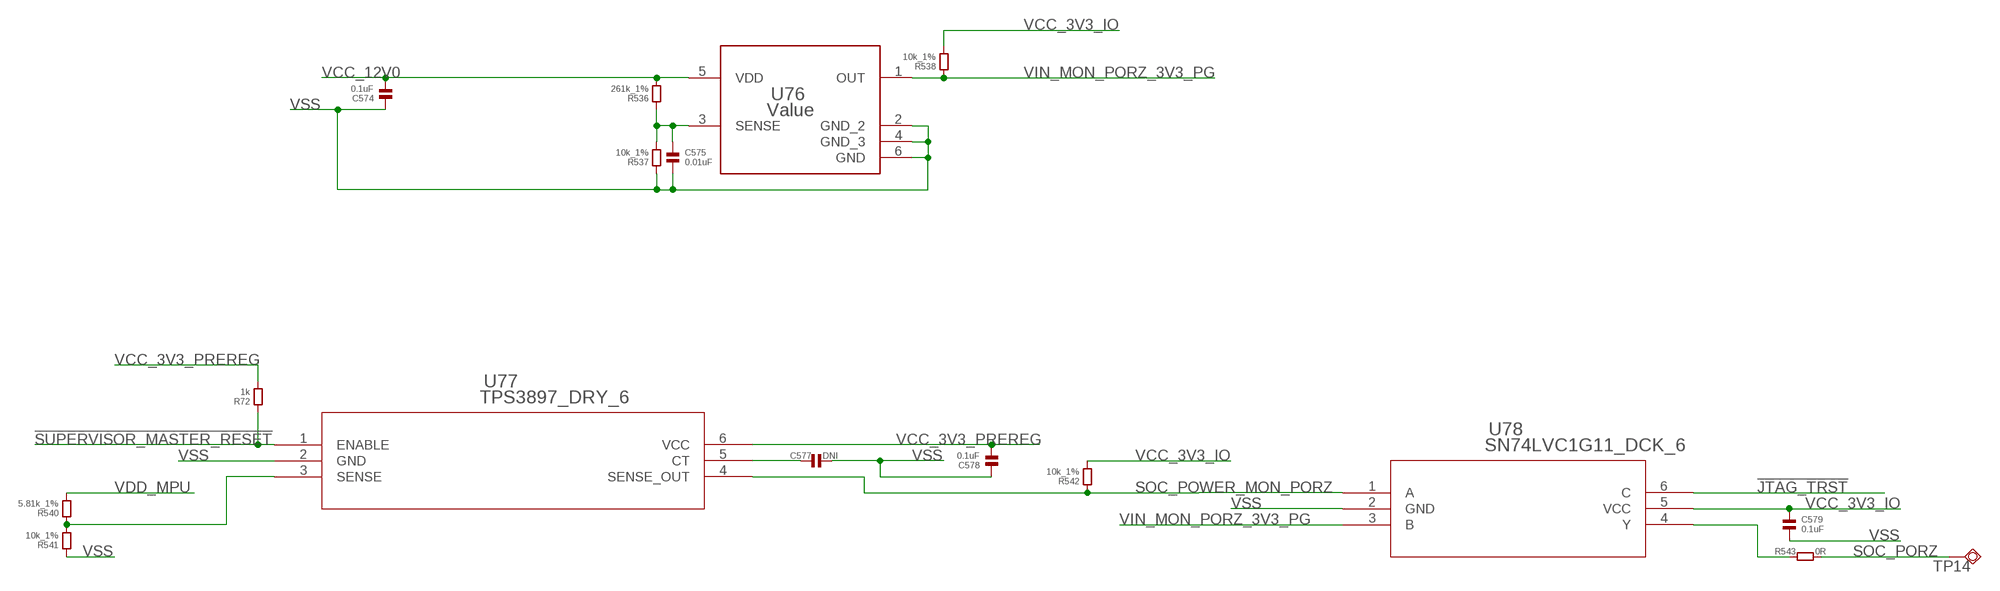
[diagram p12: schematic, sheet 11]

### Parts
C574  0.1uF  CAPACITOR.0402  [0402]
C575  0.01uF  CAPACITOR.0402  [0402]
C577  DNI  CAPACITOR.0402  [0402]
C578  0.1uF  CAPACITOR.0402  [0402]
C579  0.1uF  CAPACITOR.0402  [0402]
R72  1k  RESISTOR.0402  [0402]
R536  261k_1%  RESISTOR.0402  [0402]
R537  10k_1%  RESISTOR.0402  [0402]
R538  10k_1%  RESISTOR.0402  [0402]
R540  5.81k_1%  RESISTOR.0402  [0402]
R541  10k_1%  RESISTOR.0402  [0402]
R542  10k_1%  RESISTOR.0402  [0402]
R543  0R  RESISTOR.0402  [0402]
TP14  TESTPAD_TPSQB1,27  [TESTPAD_B1,27]
U76  Value  TPS3711DDCR  [DDC0006A_N]
U77  TPS3897_DRY_6  [DRY6]
U78  SN74LVC1G11_DCK_6  [DCK6]

### Nets
!JTAG_TRST: U78.6(C) ; also sheet 1
!SUPERVISOR_MASTER_RESET: R72.1 U77.1(ENABLE) ; also sheet 13
N$376: C575.1 R536.1 R537.2 U76.3(SENSE)
N$377: C577.1 U77.5(CT)
N$378: R543.1 U78.4(Y)
N$379: R540.1 R541.2 U77.3(SENSE)
SOC_PORZ: R543.2 TP14.TP ; also sheet 1
SOC_POWER_MON_PORZ: R542.1 U77.4(SENSE_OUT) U78.1(A)
VCC_3V3_IO: C579.1 R538.2 R542.2 U78.5(VCC) ; also sheet 1,2,4,5,6,7,8,9,10,12,13
VCC_3V3_PREREG: C578.2 R72.2 U77.6(VCC) ; also sheet 9
VCC_12V0: C574.2 R536.2 U76.5(VDD) ; also sheet 9,13
VDD_MPU: R540.2 ; also sheet 2,9,10
VIN_MON_PORZ_3V3_PG: R538.1 U76.1(OUT) U78.3(B) ; also sheet 1,9
VSS: C574.1 C575.2 C577.2 C578.1 C579.2 R537.1 R541.1 U76.2(GND_2) U76.4(GND_3) U76.6(GND) U77.2(GND) U78.2(GND) ; also sheet 1,2,3,4,5,6,7,8,9,10,12,13

## Sheet 12 of 13: Management IC
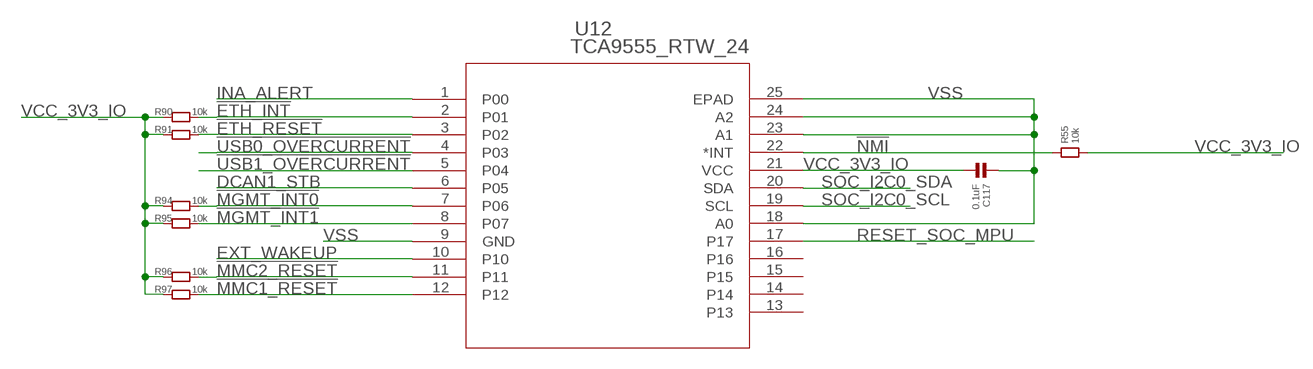
[diagram p13: schematic, sheet 12]

### Parts
C117  0.1uF  CAPACITOR.0402  [0402]
R55  10k  RESISTOR.0402  [0402]
R90  10k  RESISTOR.0402  [0402]
R91  10k  RESISTOR.0402  [0402]
R94  10k  RESISTOR.0402  [0402]
R95  10k  RESISTOR.0402  [0402]
R96  10k  RESISTOR.0402  [0402]
R97  10k  RESISTOR.0402  [0402]
U12  TCA9555_RTW_24  [RTW24_2P45X2P45]

### Nets
!ETH_INT: R90.2 U12.2(P01) ; also sheet 4
!ETH_RESET: R91.2 U12.3(P02) ; also sheet 4
!MGMT_INT0: R94.2 U12.7(P06) ; also sheet 13
!MGMT_INT1: R95.2 U12.8(P07) ; also sheet 13
!MMC1_RESET: R97.2 U12.12 ; also sheet 8
!MMC2_RESET: R96.2 U12.11 ; also sheet 8
!NMI: R55.1 U12.22(*INT) ; also sheet 1
!USB0_OVERCURRENT: U12.4(P03) ; also sheet 5
!USB1_OVERCURRENT: U12.5(P04) ; also sheet 5
DCAN1_STB: U12.6(P05) ; also sheet 1
EXT_WAKEUP: U12.10 ; also sheet 1,13
INA_ALERT: U12.1(P00) ; also sheet 10
RESET_SOC_MPU: U12.17 ; also sheet 9
SOC_I2C0_SCL: U12.19(SCL) ; also sheet 1,6,7,9,10
SOC_I2C0_SDA: U12.20(SDA) ; also sheet 1,6,7,9,10
VCC_3V3_IO: C117.2 R55.2 R90.1 R91.1 R94.1 R95.1 R96.1 R97.1 U12.21(VCC) ; also sheet 1,2,4,5,6,7,8,9,10,11,13
VSS: C117.1 U12.9(GND) U12.18(A0) U12.23(A1) U12.24(A2) U12.25(EPAD) ; also sheet 1,2,3,4,5,6,7,8,9,10,11,13
Unconnected: U12.13 U12.14 U12.15 U12.16